# EAGLE design RMCB4 (EAGLE 9.5.2)
COMPANY: ADAFRUIT INDUSTRIES; DRAWN: KTOWN; REV: B
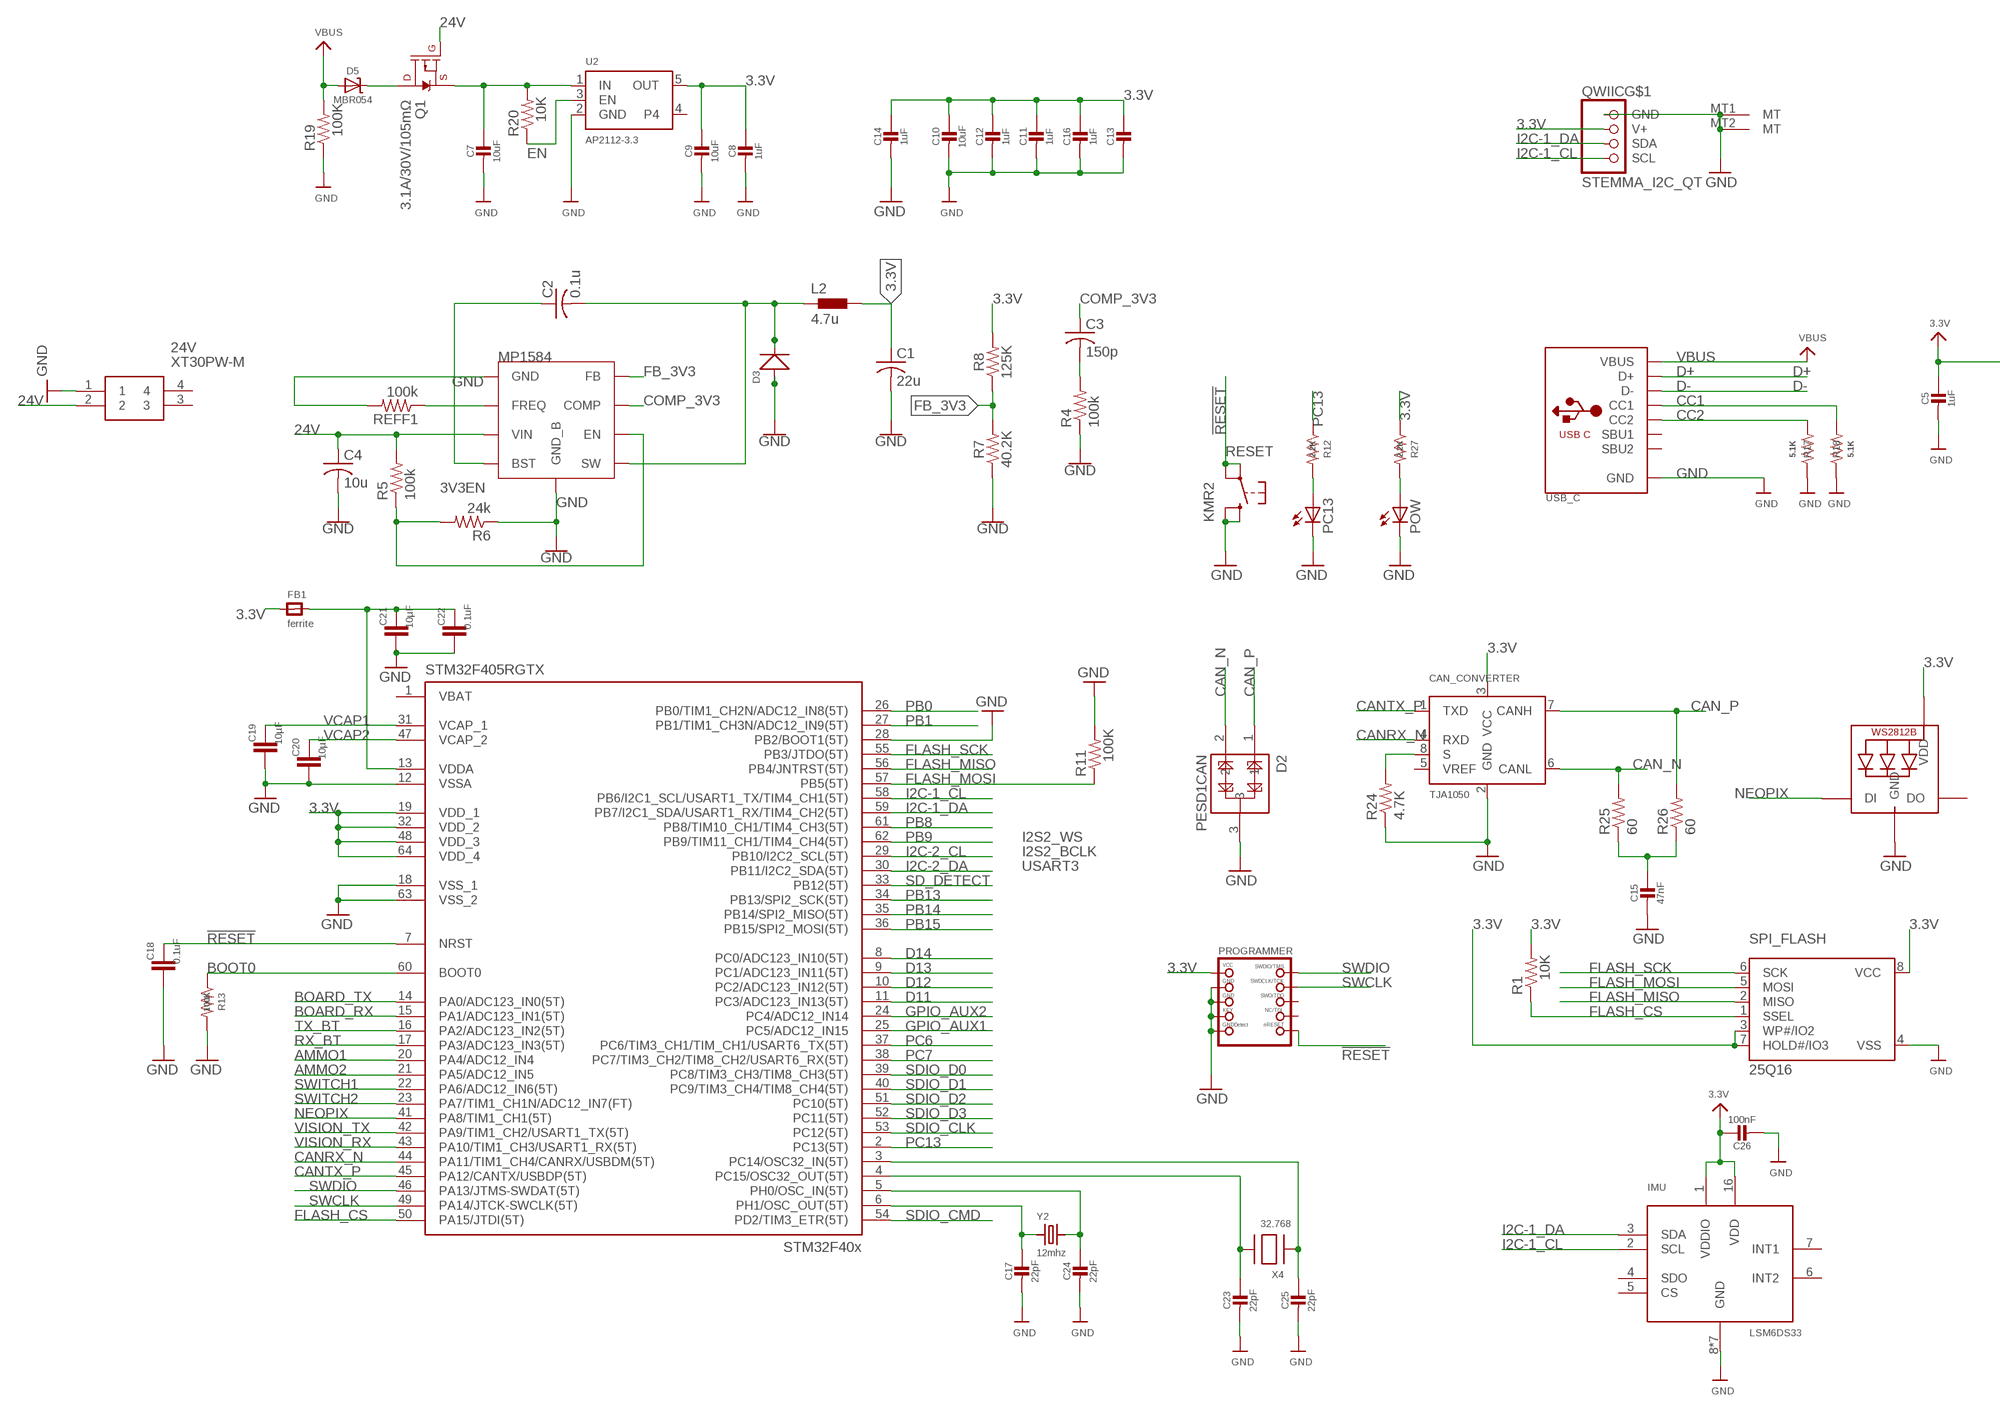
[diagram p0: schematic, sheet 1, part 1 of 2]
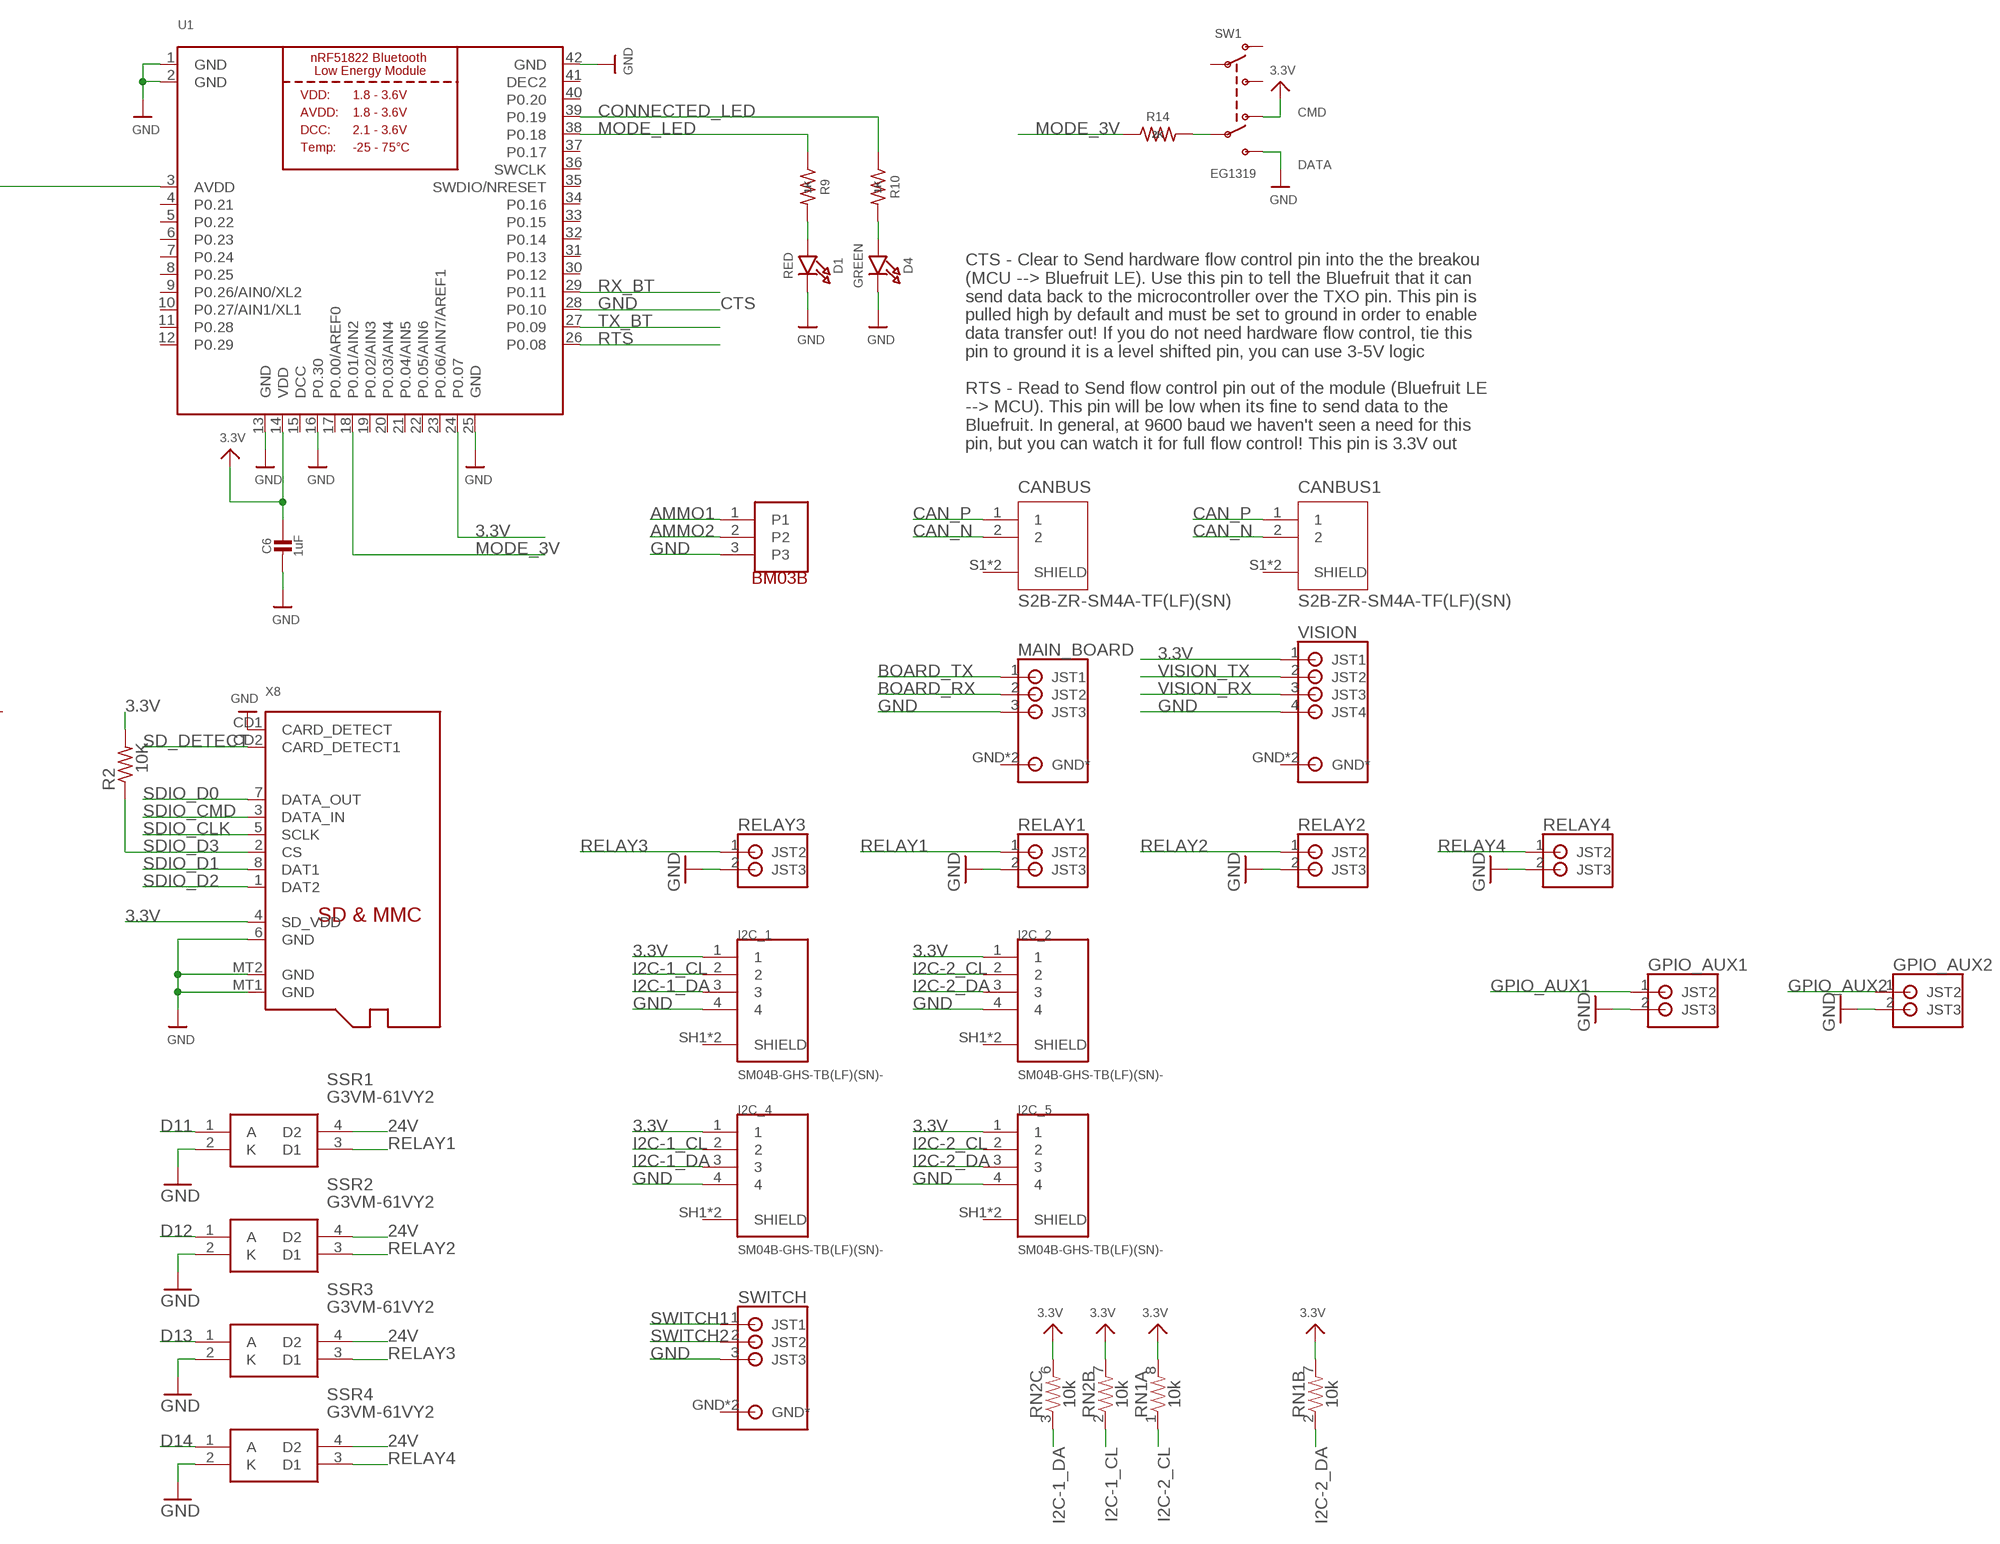
[diagram p1: schematic, sheet 1, part 2 of 2]

## Parts
24V  XT30PW-M  [XT30PWM]
AMMO_DETEC  BM03-GHS_TBT  [BM03-GHS-TBT]
C1  22u  C-USC1206  [C1206]
C2  0.1u  C-USC0603  [C0603]
C3  150p  C-USC0603  [C0603]
C4  10u  C-USC1206  [C1206]
C5  1uF  CAP_CERAMIC0805-NOOUTLINE  [0805-NO]
C6  1uF  CAP_CERAMIC0805-NOOUTLINE  [0805-NO]
C7  10uF  CAP_CERAMIC0603_NO  [0603-NO]
C8  1uF  CAP_CERAMIC0603_NO  [0603-NO]
C9  10uF  CAP_CERAMIC0603_NO  [0603-NO]
C10  10uF  CAP_CERAMIC0603_NO  [0603-NO]
C11  1uF  CAP_CERAMIC0603_NO  [0603-NO]
C12  1uF  CAP_CERAMIC0603_NO  [0603-NO]
C13  1uF  CAP_CERAMIC0603_NO  [0603-NO]
C14  1uF  CAP_CERAMIC0603_NO  [0603-NO]
C15  47nF  CAP_CERAMIC0603_NO  [0603-NO]
C16  1uF  CAP_CERAMIC0603_NO  [0603-NO]
C17  22pF  CAP_CERAMIC0603_NO  [0603-NO]
C18  0.1uF  C-EUC0603  [C0603]
C19  10µF  C-EUC0603  [C0603]
C20  10µF  C-EUC0603  [C0603]
C21  10µF  C-EUC0603  [C0603]
C22  0.1uF  C-EUC0603  [C0603]
C23  22pF  CAP_CERAMIC0603_NO  [0603-NO]
C24  22pF  CAP_CERAMIC0603_NO  [0603-NO]
C25  22pF  CAP_CERAMIC0603_NO  [0603-NO]
C26  100nF  CAP_CERAMIC0603_NO  [0603-NO]
CAN_CONVERTER  TJA1050  [SOT96-1]
CANBUS  S2B-ZR-SM4A-TF(LF)(SN)  [JST_S2B-ZR-SM4A-TF(LF)(SN)]
CANBUS1  S2B-ZR-SM4A-TF(LF)(SN)  [JST_S2B-ZR-SM4A-TF(LF)(SN)]
D1  RED  LED0805_NOOUTLINE  [CHIPLED_0805_NOOUTLINE]
D2  PESD1CAN  [SOT23-3]
D3  SMD-DIODE-SCHOTTKY-40V-3A(DO-214AB)  [DO-214AB]
D4  GREEN  LED0805_NOOUTLINE  [CHIPLED_0805_NOOUTLINE]
D5  MBR054  DIODE-SCHOTTKYSOD-123  [SOD-123]
FB1  ferrite  FERRITE-0805NO  [0805-NO@1]
GPIO_AUX1  S2B-PH-SM4_TB  [S2B-PH-SM4_TB]
GPIO_AUX2  S2B-PH-SM4_TB  [S2B-PH-SM4_TB]
I2C_1  SM04B-GHS-TB(LF)(SN)-  [JST_SM04B-GHS-TB(LF)(SN)-]
I2C_2  SM04B-GHS-TB(LF)(SN)-  [JST_SM04B-GHS-TB(LF)(SN)-]
I2C_4  SM04B-GHS-TB(LF)(SN)-  [JST_SM04B-GHS-TB(LF)(SN)-]
I2C_5  SM04B-GHS-TB(LF)(SN)-  [JST_SM04B-GHS-TB(LF)(SN)-]
IMU  LSM6DS33  [LGA16_3X3MM]
L2  4.7u  MHCI0603-4R7M-R8  [MHCI0603-4R7M-R8]
MAIN_BOARD  S3B-PH-SM4_TB  [S3B-PH-SM4_TB]
NEO  WS2812B3535  [LED3535]
PC13  LEDCHIPLED_0603  [CHIPLED_0603]
POW  LEDCHIPLED_0603  [CHIPLED_0603]
PROGRAMMER  JTAG-CORTEX  [2X05_1.27MM_SMT]
Q1  3.1A/30V/105mΩ  MOSFET_PCH-DMG2307L  [SOT23-3]
QWIIC  STEMMA_I2C_QT  [JST_SH4]
R1  10K  R-US_R0603  [R0603]
R2  10K  R-US_R0603  [R0603]
R4  100k  R-US_R0603  [R0603]
R5  100k  R-US_R0603  [R0603]
R6  24k  R-US_R0603  [R0603]
R7  40.2K  220KOHM-0603-1/10W-1%  [0603]
R8  125K  RESISTOR0603  [0603]
R9  1K  R-US_R0603  [R0603]
R10  1K  R-US_R0603  [R0603]
R11  100K  R-US_R0603  [R0603]
R12  2.2K  R-US_R0603  [R0603]
R13  100K  R-US_R0603  [R0603]
R14  2K  R-US_R0603  [R0603]
R17  5.1K  R-US_R0603  [R0603]
R18  5.1K  R-US_R0603  [R0603]
R19  100K  R-US_R0603  [R0603]
R20  10K  R-US_R0603  [R0603]
R24  4.7K  R-US_R0603  [R0603]
R25  60  R-US_R0603  [R0603]
R26  60  R-US_R0603  [R0603]
R27  2.2K  R-US_R0603  [R0603]
REFF1  100k  R-US_R0603  [R0603]
RELAY1  S2B-PH-SM4_TB  [S2B-PH-SM4_TB]
RELAY2  S2B-PH-SM4_TB  [S2B-PH-SM4_TB]
RELAY3  S2B-PH-SM4_TB  [S2B-PH-SM4_TB]
RELAY4  S2B-PH-SM4_TB  [S2B-PH-SM4_TB]
RESET  KMR2  SWITCH_TACT_SMT4.6X2.8  [BTN_KMR2_4.6X2.8]
RN1  10k  1KOHM-ARRAY(4)-0805_ARV-1/10W-5%  [0805-ARV]
RN2  10k  1KOHM-ARRAY(4)-0805_ARV-1/10W-5%  [0805-ARV]
SPI_FLASH  25Q16  SPIFLASH_8PIN  [SOIC8_150MIL]
SSR1  G3VM-61VY2  [SOP254P700X230-4N]
SSR2  G3VM-61VY2  [SOP254P700X230-4N]
SSR3  G3VM-61VY2  [SOP254P700X230-4N]
SSR4  G3VM-61VY2  [SOP254P700X230-4N]
STM32F405RGTX  STM32F405R  [TQFP64]
SW1  EG1319  SWITCH_DPDTEG1390  [EG1390]
SWITCH  S3B-PH-SM4_TB  [S3B-PH-SM4_TB]
U1  NRF51822_MODULE_MDBT40  [BLE_MODULE_RAYTAC_MDBT40]
U2  AP2112-3.3  VREG_SOT23-5  [SOT23-5]
U$10  MP1584_V2  [MP1584_V2]
USB_C  USB_C  [USB_C_CUSB31-CFM2AX-01-X]
VISION  S4B-PH-SM4_TB  [S4B-PH-SM4_TB]
X4  32.768  XTAL-3.2X1.5  [XTAL3215]
X8  MICROSD  [MICROSD]
Y2  12mhz  CRYSTAL2.5X2.0  [CRYSTAL_2.5X2]

## Nets
3.3V: C1.1 C5.1 C6.1 C8.1 C9.1 C10.1 C11.1 C12.1 C13.1 C14.1 C16.1 C26.1 CAN_CONVERTER.3(VCC) FB1.1 I2C_1.1 I2C_2.1 I2C_4.1 I2C_5.1 IMU.1(VDDIO) IMU.16(VDD) L2.P$2 NEO.2(VDD) PROGRAMMER.1(VCC) QWIIC.2(V+) R1.2 R2.2 R8.2 R27.1 RN1.7 RN1.8 RN2.6 RN2.7 SPI_FLASH.3(WP#/IO2) SPI_FLASH.7(HOLD#/IO3) SPI_FLASH.8(VCC) STM32F405RGTX.19(VDD_1) STM32F405RGTX.32(VDD_2) STM32F405RGTX.48(VDD_3) STM32F405RGTX.64(VDD_4) SW1.O2 U1.3(AVDD) U1.14(VDD) U1.24(P0.07) U2.5(OUT) VISION.1(JST1) X8.4(SD_VDD)
3V3EN: R5.1 R6.2 U$10.EN
24V [power]: 24V.2 C4.1 Q1.1(G) R5.2 SSR1.4(D2) SSR2.4(D2) SSR3.4(D2) SSR4.4(D2) U$10.VIN
!RESET: C18.1 PROGRAMMER.10(NRESET) RESET.A'(P1) RESET.A(P) STM32F405RGTX.7(NRST)
AMMO1: AMMO_DETEC.1 STM32F405RGTX.20(PA4/ADC12_IN4)
AMMO2: AMMO_DETEC.2 STM32F405RGTX.21(PA5/ADC12_IN5)
BOARD_RX: MAIN_BOARD.2(JST2) STM32F405RGTX.15(PA1/ADC123_IN1(5T))
BOARD_TX: MAIN_BOARD.1(JST1) STM32F405RGTX.14(PA0/ADC123_IN0(5T))
BOOT0: R13.1 STM32F405RGTX.60(BOOT0)
BST1: C2.1 U$10.BST
CAN_N: CAN_CONVERTER.6(CANL) CANBUS1.2 CANBUS.2 D2.2 R25.2
CAN_P: CAN_CONVERTER.7(CANH) CANBUS1.1 CANBUS.1 D2.1 R26.2
CANRX_N: CAN_CONVERTER.4(RXD) STM32F405RGTX.44(PA11/TIM1_CH4/CANRX/USBDM(5T))
CANTX_P: CAN_CONVERTER.1(TXD) STM32F405RGTX.45(PA12/CANTX/USBDP(5T))
CC1: R18.2 USB_C.A5(CC1)
CC2: R17.2 USB_C.B5(CC2)
COMP_3V3: C3.1 U$10.COMP
CONNECTED_LED: R10.1 U1.39(P0.19)
D11: SSR1.1(A) STM32F405RGTX.11(PC3/ADC123_IN13(5T))
D12: SSR2.1(A) STM32F405RGTX.10(PC2/ADC123_IN12(5T))
D13: SSR3.1(A) STM32F405RGTX.9(PC1/ADC123_IN11(5T))
D14: SSR4.1(A) STM32F405RGTX.8(PC0/ADC123_IN10(5T))
D+: USB_C.A6(D+) USB_C.B6(D+)
D-: USB_C.A7(D-) USB_C.B7(D-)
EN: R20.1 U2.3(EN)
FB_3V3: R7.2 R8.1 U$10.FB
FLASH_CS: R1.1 SPI_FLASH.1(SSEL) STM32F405RGTX.50(PA15/JTDI(5T))
FLASH_MISO: SPI_FLASH.2(MISO) STM32F405RGTX.56(PB4/JNTRST(5T))
FLASH_MOSI: R11.1 SPI_FLASH.5(MOSI) STM32F405RGTX.57(PB5(5T))
FLASH_SCK: SPI_FLASH.6(SCK) STM32F405RGTX.55(PB3/JTDO(5T))
FREQ1: REFF1.1 U$10.FREQ
GND [gnd]: 24V.1 AMMO_DETEC.3 C1.2 C4.2 C5.2 C6.2 C7.2 C8.2 C9.2 C10.2 C11.2 C12.2 C13.2 C14.2 C15.2 C16.2 C17.2 C18.2 C19.2 C20.2 C21.2 C22.2 C23.2 C24.2 C25.2 C26.2 CAN_CONVERTER.2(GND) D1.C D2.3 D3.1(+) D4.C GPIO_AUX1.2(JST3) GPIO_AUX2.2(JST3) I2C_1.4 I2C_2.4 I2C_4.4 I2C_5.4 IMU.8(GND) IMU.9(GND) IMU.10(GND) IMU.11(GND) IMU.12(GND) IMU.13(GND) IMU.15(GND) MAIN_BOARD.3(JST3) NEO.4(GND) PC13.C POW.C PROGRAMMER.3(GND) PROGRAMMER.5(GND) PROGRAMMER.7(KEY) PROGRAMMER.9(GNDDETECT) QWIIC.1(GND) QWIIC.MT1(MT) QWIIC.MT2(MT) R4.1 R6.1 R7.1 R11.2 R13.2 R17.1 R18.1 R19.1 R24.1 REFF1.2 RELAY1.2(JST3) RELAY2.2(JST3) RELAY3.2(JST3) RELAY4.2(JST3) RESET.B'(S1) RESET.B(S) SPI_FLASH.4(VSS) SSR1.2(K) SSR2.2(K) SSR3.2(K) SSR4.2(K) STM32F405RGTX.12(VSSA) STM32F405RGTX.18(VSS_1) STM32F405RGTX.28(PB2/BOOT1(5T)) STM32F405RGTX.63(VSS_2) SW1.S2 SWITCH.3(JST3) U1.1(GND) U1.2(GND) U1.13(GND) U1.16(P0.30) U1.25(GND) U1.28(P0.10) U1.42(GND) U2.2(GND) U$10.GND U$10.GND_B USB_C.A1B12(GND) USB_C.B1A12(GND) VISION.4(JST4) X8.6(GND) X8.CD1(CARD_DETECT) X8.MT1(GND) X8.MT2(GND)
GPIO_AUX1: GPIO_AUX1.1(JST2) STM32F405RGTX.25(PC5/ADC12_IN15)
GPIO_AUX2: GPIO_AUX2.1(JST2) STM32F405RGTX.24(PC4/ADC12_IN14)
I2C-1_CL: I2C_1.2 I2C_4.2 IMU.2(SCL) QWIIC.4(SCL) RN2.2 STM32F405RGTX.58(PB6/I2C1_SCL/USART1_TX/TIM4_CH1(5T))
I2C-1_DA: I2C_1.3 I2C_4.3 IMU.3(SDA) QWIIC.3(SDA) RN2.3 STM32F405RGTX.59(PB7/I2C1_SDA/USART1_RX/TIM4_CH2(5T))
I2C-2_CL: I2C_2.2 I2C_5.2 RN1.1 STM32F405RGTX.29(PB10/I2C2_SCL(5T))
I2C-2_DA: I2C_2.3 I2C_5.3 RN1.2 STM32F405RGTX.30(PB11/I2C2_SDA(5T))
MODE_3V: R14.1 U1.18(P0.01/AIN2)
MODE_LED: R9.1 U1.38(P0.18)
N$3: C3.2 R4.2
N$4: R14.2 SW1.P2
N$5: D1.A R9.2
N$6: D4.A R10.2
N$9: C25.1 STM32F405RGTX.3(PC14/OSC32_IN(5T)) X4.P$1
N$10: C23.1 STM32F405RGTX.4(PC15/OSC32_OUT(5T)) X4.P$2
N$11: C24.1 STM32F405RGTX.5(PH0/OSC_IN(5T)) Y2.3
N$12: C17.1 STM32F405RGTX.6(PH1/OSC_OUT(5T)) Y2.1
N$13: PC13.A R12.2
N$20: C21.1 C22.1 FB1.2 STM32F405RGTX.13(VDDA)
N$21: CAN_CONVERTER.8(S) R24.2
N$22: C15.1 R25.1 R26.1
N$23: POW.A R27.2
N$32: D5.C Q1.3(D)
NEOPIX: NEO.1(DI) STM32F405RGTX.41(PA8/TIM1_CH1(5T))
PB0: STM32F405RGTX.26(PB0/TIM1_CH2N/ADC12_IN8(5T))
PB1: STM32F405RGTX.27(PB1/TIM1_CH3N/ADC12_IN9(5T))
PB8: STM32F405RGTX.61(PB8/TIM10_CH1/TIM4_CH3(5T))
PB9: STM32F405RGTX.62(PB9/TIM11_CH1/TIM4_CH4(5T))
PB13: STM32F405RGTX.34(PB13/SPI2_SCK(5T))
PB14: STM32F405RGTX.35(PB14/SPI2_MISO(5T))
PB15: STM32F405RGTX.36(PB15/SPI2_MOSI(5T))
PC6: STM32F405RGTX.37(PC6/TIM3_CH1/TIM_CH1/USART6_TX(5T))
PC7: STM32F405RGTX.38(PC7/TIM3_CH2/TIM8_CH2/USART6_RX(5T))
PC13: R12.1 STM32F405RGTX.2(PC13(5T))
RELAY1: RELAY1.1(JST2) SSR1.3(D1)
RELAY2: RELAY2.1(JST2) SSR2.3(D1)
RELAY3: RELAY3.1(JST2) SSR3.3(D1)
RELAY4: RELAY4.1(JST2) SSR4.3(D1)
RTS: U1.26(P0.08)
RX_BT: STM32F405RGTX.17(PA3/ADC123_IN3(5T)) U1.29(P0.11)
SD_DETECT: STM32F405RGTX.33(PB12(5T)) X8.CD2(CARD_DETECT1)
SDIO_CLK: STM32F405RGTX.53(PC12(5T)) X8.5(SCLK)
SDIO_CMD: STM32F405RGTX.54(PD2/TIM3_ETR(5T)) X8.3(DATA_IN)
SDIO_D0: STM32F405RGTX.39(PC8/TIM3_CH3/TIM8_CH3(5T)) X8.7(DATA_OUT)
SDIO_D1: STM32F405RGTX.40(PC9/TIM3_CH4/TIM8_CH4(5T)) X8.8(DAT1)
SDIO_D2: STM32F405RGTX.51(PC10(5T)) X8.1(DAT2)
SDIO_D3: R2.1 STM32F405RGTX.52(PC11(5T)) X8.2(CS)
SW1: C2.2 D3.2(-) L2.P$1 U$10.SW
SWCLK: PROGRAMMER.4(SWDCLK) STM32F405RGTX.49(PA14/JTCK-SWCLK(5T))
SWDIO: PROGRAMMER.2(SWDIO) STM32F405RGTX.46(PA13/JTMS-SWDAT(5T))
SWITCH1: STM32F405RGTX.22(PA6/ADC12_IN6(5T)) SWITCH.1(JST1)
SWITCH2: STM32F405RGTX.23(PA7/TIM1_CH1N/ADC12_IN7(FT)) SWITCH.2(JST2)
TX_BT: STM32F405RGTX.16(PA2/ADC123_IN2(5T)) U1.27(P0.09)
VBUS [power]: D5.A R19.2 USB_C.A4B9(VBUS) USB_C.B4A9(VBUS)
VCAP1: C19.1 STM32F405RGTX.31(VCAP_1)
VCAP2: C20.1 STM32F405RGTX.47(VCAP_2)
VHI: C7.1 Q1.2(S) R20.2 U2.1(IN)
VISION_RX: STM32F405RGTX.43(PA10/TIM1_CH3/USART1_RX(5T)) VISION.3(JST3)
VISION_TX: STM32F405RGTX.42(PA9/TIM1_CH2/USART1_TX(5T)) VISION.2(JST2)
Unconnected: 24V.3 24V.4 CAN_CONVERTER.5(VREF) CANBUS1.S1(SHIELD) CANBUS1.S2(SHIELD) CANBUS.S1(SHIELD) CANBUS.S2(SHIELD) IMU.4(SDO) IMU.5(CS) IMU.6(INT2) IMU.7(INT1) MAIN_BOARD.GND2(GND*) MAIN_BOARD.GND(GND*) NEO.3(DO) PROGRAMMER.6(SWO) PROGRAMMER.8(TDI) RN1.3 RN1.4 RN1.5 RN1.6 RN2.1 RN2.4 RN2.5 RN2.8 STM32F405RGTX.1(VBAT) SW1.O1 SW1.P1 SW1.S1 SWITCH.GND2(GND*) SWITCH.GND(GND*) U1.4(P0.21) U1.5(P0.22) U1.6(P0.23) U1.7(P0.24) U1.8(P0.25) U1.9(P0.26/AIN0/XL2) U1.10(P0.27/AIN1/XL1) U1.11(P0.28) U1.12(P0.29) U1.17(P0.00/AREF0) U1.19(P0.02/AIN3) U1.20(P0.03/AIN4) U1.21(P0.04/AIN5) U1.22(P0.05/AIN6) U1.23(P0.06/AIN7/AREF1) U1.30(P0.12) U1.31(P0.13) U1.32(P0.14) U1.33(P0.15) U1.34(P0.16) U1.35(SWDIO/NRESET) U1.36(SWCLK) U1.37(P0.17) U1.40(P0.20) U2.4 USB_C.A8(SBU1) USB_C.B8(SBU2) VISION.GND2(GND*) VISION.GND(GND*)

## Notes on the sheet
- CMD
- DATA
- CTS
- CTS - Clear to Send hardware flow control pin into the the breakou 
  (MCU --> Bluefruit LE). Use this pin to tell the Bluefruit that it can 
  send data back to the microcontroller over the TXO pin. This pin is 
  pulled high by default and must be set to ground in order to enable 
  data transfer out! If you do not need hardware flow control, tie this 
  pin to ground it is a level shifted pin, you can use 3-5V logic
  
  RTS - Read to Send flow control pin out of the module (Bluefruit LE 
  --> MCU). This pin will be low when its fine to send data to the 
  Bluefruit. In general, at 9600 baud we haven't seen a need for this 
  pin, but you can watch it for full flow control! This pin is 3.3V out
- I2S2_WS
- I2S2_BCLK
- USART3

## Power pins joined to a net without a drawn wire
DCC: U1.15(DCC)
DEC2: U1.41(DEC2)
SHIELD: I2C_1.SH1(SHIELD) I2C_1.SH2(SHIELD) I2C_2.SH1(SHIELD) I2C_2.SH2(SHIELD) I2C_4.SH1(SHIELD) I2C_4.SH2(SHIELD) I2C_5.SH1(SHIELD) I2C_5.SH2(SHIELD)

## Library data of the parts
24V = SamacSys_Parts:XT30PW-M: 30A Low Temperature Rise Fire Retardant Plug Source: Datasheet <https://www.tme.eu/sl/Document/ce4077e36b79046da520ca73227e15de/XT30PW SPEC.pdf>; DESCRIPTION: 30A Low Temperature Rise Fire Retardant Plug; HEIGHT: 5mm; MANUFACTURER_NAME: Amass; MANUFACTURER_PART_NUMBER: XT30PW-M
AMMO_DETEC = SamacSys_Parts:BM03-GHS_TBT
C1-C4 = adafruit:C-US: CAPACITOR, American symbol
C5-C17 C23-C26 = microbuilder:CAP_CERAMIC: Ceramic Capacitors For new designs, use the packages preceded by an '_' character since they are more reliable: The following footprints should be used on most boards: _0402 - Standard footprint for regular board layouts _0603 - Standard footprint for regular board layouts _0805 - Standard footprint for regular board layouts _1206 - Standard footprint for regular board layouts For extremely tight-pitch boards where space is at a premium, the following 'micro-pitch' footprints can be used (smaller pads, no silkscreen outline, etc.): _0402MP - Micro-pitch footprint for very dense/compact boards _0603MP - Micro-pitch footprint for very dense/compact boards _0805MP - Micro-pitch footprint for very dense/compact boards _1206MP - Micro-pitch footprint for very dense/compact boards
C18-C22 = rcl:C-EU: CAPACITOR, European symbol; SPICEPREFIX: C
CAN_CONVERTER = TJA1050:TJA1050: High speed CAN transceiver The TJA1050 is the interface between the Controller Area Network (CAN) protocol controller and the physical bus. The device provides differential transmit capability to the bus and differential receive capability to the CAN controller. The TJA1050 is the third Philips high-speed CAN transceiver after the PCA82C250 and the PCA82C251. The most important differences are: Much lower electromagnetic emission due to optimal matching of the output signals CANH and CANL Improved behaviour in case of an unpowered node No standby mode. This makes the TJA1050 eminently suitable for use in nodes that are in a power-down situation in partially powered networks. AAL Eindhoven MK; AVAILABILITY: Unavailable; DESCRIPTION: 1/1 Transceiver Half CANbus 8-SO; MF: NXP USA; MP: TJA1050; PACKAGE: SOIC-8 NXP USA; PRICE: None
CANBUS CANBUS1 = S2B-ZR-SM4A-TF_LF__SN_:S2B-ZR-SM4A-TF(LF)(SN): ZH Series 2 Position 1.5 mm Pitch Surface Mount Side Entry Shrouded Header; AVAILABILITY: Unavailable; DESCRIPTION: Connector Header Surface Mount, Right Angle 2 position 0.059 _1.50mm_; MF: JST Sales; MP: S2B-ZR-SM4A-TF_LF__SN_; PACKAGE: None; PRICE: None
D1 D4 = microbuilder:LED: LED
D2 = PESD1CAN:PESD1CAN: PESD1CAN is used to protect two automotive CAN bus lines from ESD.; AVAILABILITY: Unavailable; DESCRIPTION: 50V Clamp 3A _8/20µs_ Ipp Tvs Diode Surface Mount SC-70; MF: NXP Semiconductors; MP: PESD1CAN; PACKAGE: SC-70 NXP Semiconductors; PRICE: None
D3 = SMD-DIODE-SCHOTTKY-40V-3A_DO-214AB_:SMD-DIODE-SCHOTTKY-40V-3A(DO-214AB): 304020018; AVAILABILITY: Unavailable; DESCRIPTION: Rectifier, Schottky; DO-214AB; 3.0A IF; 0.75V; 40V; 100A IFRM; 10000V/us; 1000pF; MF: Vishay; MP: SS34-E3/57T; PACKAGE: DO-214 Vishay; PRICE: None
D5 = microbuilder:DIODE-SCHOTTKY
FB1 = microbuilder:FERRITE: Ferrite Bead 0603 MMZ1608B121C - 120 Ohm @ 100MHz, 600mA, 0.15 Ohm DC Resistance - Digikey: 445-2164-1-ND BK1608HW121-T - 120 Ohm, 600mA Ferrite Chip - Digikey: 587-1876-2-ND 0805 HZ0805B272R-10 - 2.7K Ohm @ 100MHz, 200mA, 0.8 Ohm DC Resistance - Digikey: 240-2504-1-ND (see also Murata BLM21BD272SN1L) MMZ2012Y152B - 1.5K Ohm @ 100MHz, 500mA, 0.4 Ohm DC Resistance - Digikey: 445-1560-1-ND - Mainly for high frequency (80-400MHz) MMZ2012R102A - 1K Ohm @ 100MHz, 500mA, 0.3 Ohm DC Resistance - Digikey: 445-1555-2-ND - More general purpose (10-200MHz)
GPIO_AUX1 GPIO_AUX2 RELAY1-RELAY4 = KevinMade:S2B-PH-SM4_TB
I2C_1 I2C_2 I2C_4 I2C_5 = SM04B-GHS-TB_LF__SN_-:SM04B-GHS-TB(LF)(SN)-: Conn Header Gh Side 4pos 1.25mm; AVAILABILITY: Unavailable; DESCRIPTION: Connector Header Surface Mount, Right Angle 4 position 0.049 _1.25mm_; MF: JST Sales; MP: SM04B-GHS-TB_LF__SN_-; PACKAGE: None; PRICE: None
IMU = adafruit_sensor:LSM6DS33
L2 = NewKevinMade:MHCI0603-4R7M-R8
MAIN_BOARD SWITCH = KevinMade:S3B-PH-SM4_TB
NEO = microbuilder:WS2812B
PC13 POW = adafruit:LED: LED
PROGRAMMER = microbuilder:JTAG-CORTEX: Serial Wire (SW-DP) Connector Standard 0.05" 10-pin connector is for use with the Cortex M and Cortex A SWD (serial wire debugger) interface (SW-DP) Connectors 2x05_1.27MM_SMT - Inexpensive surface-mount header with bare pins, compatible with standard 10-pin SWD cables (4UCON: 16846) 2x05_1.27MM_BOX_NOPOSTS - Polarised surface-mount box (4UCON with caps: 19735, without caps: 15117 2x05_1.27MM_BOX_POSTS - Polarised surface-mount box with mounting holes (4UCON: 20317) Pinout: http://infocenter.arm.com/help/topic/com.arm.doc.faqs/attached/13634/cortex_debug_connectors.pdf http://www.keil.com/peripherals/coresight/connectors.asp
Q1 = SparkFun-DiscreteSemi:MOSFET_PCH: P-channel MOSFETs Voltage controlled devices that allow control of high current outputs. SparkFun Products: SparkFun ESP32 Thing <https://www.sparkfun.com/products/13907> SparkFun ESP8266 Thing <https://www.sparkfun.com/products/13231> SparkFun Pi Servo HAT V2 <https://www.sparkfun.com/products/15316> DMG2305UX-7 (20V/4.2A/SOT23-3); PROD_ID: TRANS-11308
QWIIC = microbuilder:STEMMA_I2C
R1 R2 R9-R14 R17-R20 R27 = rcl:R-US_: RESISTOR, American symbol; SPICEPREFIX: R
R4-R6 R24-R26 REFF1 = adafruit:R-US_: RESISTOR, American symbol
R7 = SparkFun-Resistors:220KOHM: 220kΩ resistor A resistor is a passive two-terminal electrical component that implements electrical resistance as a circuit element. Resistors act to reduce current flow, and, at the same time, act to lower voltage levels within circuits. - Wikipedia; PROD_ID: RES-08969; VALUE: 220k
R8 = SparkFun-Resistors:RESISTOR: Generic Resistor Package
RESET = microbuilder:SWITCH_TACT_SMT: SMT Tact Switches 6x6mm - Digikey: P12940SCT-ND KMR2 (4.6x2.8mm) - Digikey: 401-1426-1-ND EVQ-PQHB55 - Light Touch, 160GF (4.5x4.5mm) - Digikey: P8090SCT-ND KMT0 - KMT021 NGJ LHS (etc.) IP68/Waterproof - Digikey: CKN10289CT-ND
RN1 RN2 = SparkFun-Resistors:1KOHM-ARRAY(4): 4 x 1kΩ resistor array A resistor is a passive two-terminal electrical component that implements electrical resistance as a circuit element. Resistors act to reduce current flow, and, at the same time, act to lower voltage levels within circuits. - Wikipedia An array is a collection of discrete resistors in a single package.; PROD_ID: RES-13020; VALUE: 1k
SPI_FLASH = microbuilder:SPIFLASH_8PIN: SOIC8 SPI Flash Be careful with the size since SOIC8 flash comes in several 'widths' SOIC8 150 mil M25P16 - 16Mbit (2Mbit x 8) Serial Flash (75MHz SPI Bus), Supply: 2.7-3.6V Digikey: SOIC8 - M25P16-VMN6P-ND SOIC8 208 mil W25Q16BVSSIG - 16Mbit (2Mbit x 8) Serial Flash (104MHz SPI Bus), Supply: 2.7-3.6V Digikey: SOIC8 - W25Q16BVSSIG-ND
SSR1-SSR4 = SamacSys_Parts:G3VM-61VY2: Solid State Relays - PCB Mount Mos Fet Relay, SMT 60V, 1 form A,SOP4 Source: Datasheet <https://componentsearchengine.com/Datasheets/1/G3VM-61VY2.pdf>; DESCRIPTION: Solid State Relays - PCB Mount Mos Fet Relay, SMT 60V, 1 form A,SOP4; HEIGHT: 2.3mm; MANUFACTURER_NAME: Omron Electronics; MANUFACTURER_PART_NUMBER: G3VM-61VY2; MOUSER_PART_NUMBER: 653-G3VM61VY2; MOUSER_PRICE-STOCK: https://www.mouser.com/Search/Refine.aspx?Keyword=653-G3VM61VY2
STM32F405RGTX = adafruit_micro:STM32F405R: STM32F405 64 pin LQFP reviewed: YES tested: YES
SW1 = microbuilder:SWITCH_DPDT: Switch - DPDT A DPDT Switch acts like an SPDT switch, but has a pair of switches instead of just one. Vertical - 0.3A @ 6V SMT - Digikey: JS202011SCQN
U1 = microbuilder:NRF51822_MODULE_MDBT40: nRF51822 Bluetooth Low Energy Module
U2 = microbuilder:VREG_SOT23-5: SOT23-5 Fixed Voltage Regulators Part Current Out V Out V In V Dropout θJA (°C/W) TJ (°C) Digikey Part No. ADP121 150mA 3.3V 3.4-5.5V 0.09V @ 150mA -- -- ADP121-AUJZ33R7CT-ND ADP121 150mA 3.0V 3.1-5.5V 0.09V @ 150mA -- -- ADP121-AUJZ30R7CT-ND ADP122 300mA 3.3V 3.4-5.5V 0.085V @ 300mA -- -- ADP122AUJZ-3.3-R7CT-ND ADP1712 300mA 3.3V 3.5-5.5V 0.17V @ 300mA -- -- ADP1712AUJZ-3.3-R7TR-ND AP7311 (Low Cost) 150mA 3.3V 3.5-6V 0.15V @ 150mA -- -- AP7311-33WG-7DICT-ND LD39015M18R 150mA 1.8V 1.9V-5.5V 0.08V @ 100mA -- -- 497-6977-1-ND LP2985A-33DBVR 150mA 3.3V 3.3-16V 0.28V @ 150mA 206 150 296-18479-1-ND MCP1824T-3302E/OT 300mA 3.3V 3.5V-6V 0.2V @ 300mA -- -- MCP1824T-3302E/OTCT-ND MIC5205-2.5YM5 TR 150mA 2.5V 2.7-16V 0.165V @ 150mA -- -- 576-1257-2-ND MIC5205-3.0YM5 TR 150mA 3.0V 3.2V-16V 0.165V @ 150mA -- -- 576-1258-2-ND MIC5205-3.3YM5 TR 150mA 3.3V 3.5V-16V 0.165V @ 150mA -- -- 576-1259-2-ND TPS780330220 150mA 3.3V+2.2V 3.6-5.5V 250mV Max -- -- 296-23332-1-ND TDA3663/N1,135 100mA 3.3V 3.5-45V 0.18V @ 50mA -- -- 568-5343-1-ND Max operating temp can be calculated using θJA, TJ (max junction temperature), and power in watts. Set the "Maximum Ambient Temperature" until it reaches TJ ("Max Junction Temperature"), which is the absolute limit for safe use of the regulator: Heat Sink Temperature Calculator <http://www.daycounter.com/Calculators/Heat-Sink-Temperature-Calculator.phtml> For example, With 12V source into a 3.3V LP2985 and a 30mA load, we are dissipating (12V-3.3V) * 0.03A = 0.261W. With a θJA of 206 °C/W, a TJ of 150°C, and 261mW we can safely use the chip without a heat sink up to 75°C (=147.1°C Junction Temperature).
U$10 = mp1584S:MP1584_V2
USB_C = microbuilder:USB_C: USB Type-C USB 2.0 Connector
VISION = KevinMade:S4B-PH-SM4_TB
X4 = adafruit2:XTAL: Low cost SMT crystals, no capacitors included http://www.ladyada.net/library/eagle
X8 = microbuilder:MICROSD: MicroSD/Transflash Card Holder with SPI pinout 3M: 2908-05WB-MG 4UConnector: 19656 Footprint courtesy: Adafruit Industries
Y2 = microbuilder:CRYSTAL: Crystals HC49UP - Surface Mount Crystal 4.0MHz 18pF +/-30ppm Surface Mount Crystal [Digikey: 535-9857-1-ND] 12.0 MHz Surface Mount Crystal [Digikey: 535-9869-6-ND] 25.0 MHz Surface Mount Crystal [Digikey: 535-9078-1-ND] 2.5 x 2.0mm - MEMs SMT Crystal 16.0 MHz 10pF 20ppm 2.5 x 2.0mm Crystal [Digikey -40-85°C: 535-10923-1-ND] 3.2 x 2.5mm - MEMs SMT Crystal 12.0 MHz 8pF 15ppm 3.2 x 2.5mm Crystal [Digikey: -10-70°C: 644-1047-1-ND -40-125°C: 644-1128-1-ND] 40~85°C cheaper: 644-1173-6-ND 16.0 MHz 8pF 15ppm 3.2 x 2.5mm Crystal [Digikey: -10-70°C: 644-1049-1-ND -40-125°C: 644-1129-2-ND]-40~85°C cheaper: 644-1175-6-ND 16.0 MHz 10pF 10ppm 3.2 x 2.5mm Crystal [Digikey: 644-1100-1-ND] 27.12 MHz 18pF 30ppm 3.2 x 2.5mm Crystal [Digikey: 887-1424-1-ND] 27.12MHz 10pF 10ppm 3.2 x 2.5mm Crystal [Digikey: 887-1329-1-ND] 4.9 x 1.8mm - MEMs SMT Crystal 32.768 KHz 12.5pF 20ppm 4.9 x 1.8mm Crystal [Digikey: SE2415CT-ND] 8.0 x 3.8mm - Surface Mount Crystal 32.768kHz 12.5pF 20ppm -40°C-85°C [Digikey: 535-9166-2-ND] Cylinder 32.768KHz Cylinder Crystal (2x6mm body) [Ex. Digikey: 300-8341-2-ND]

## Net classes
1 power: width 0.305 mm
2 gnd: width 0.254 mm
3 can: width 0.203 mm
4 canx: width 0.203 mm

## Board
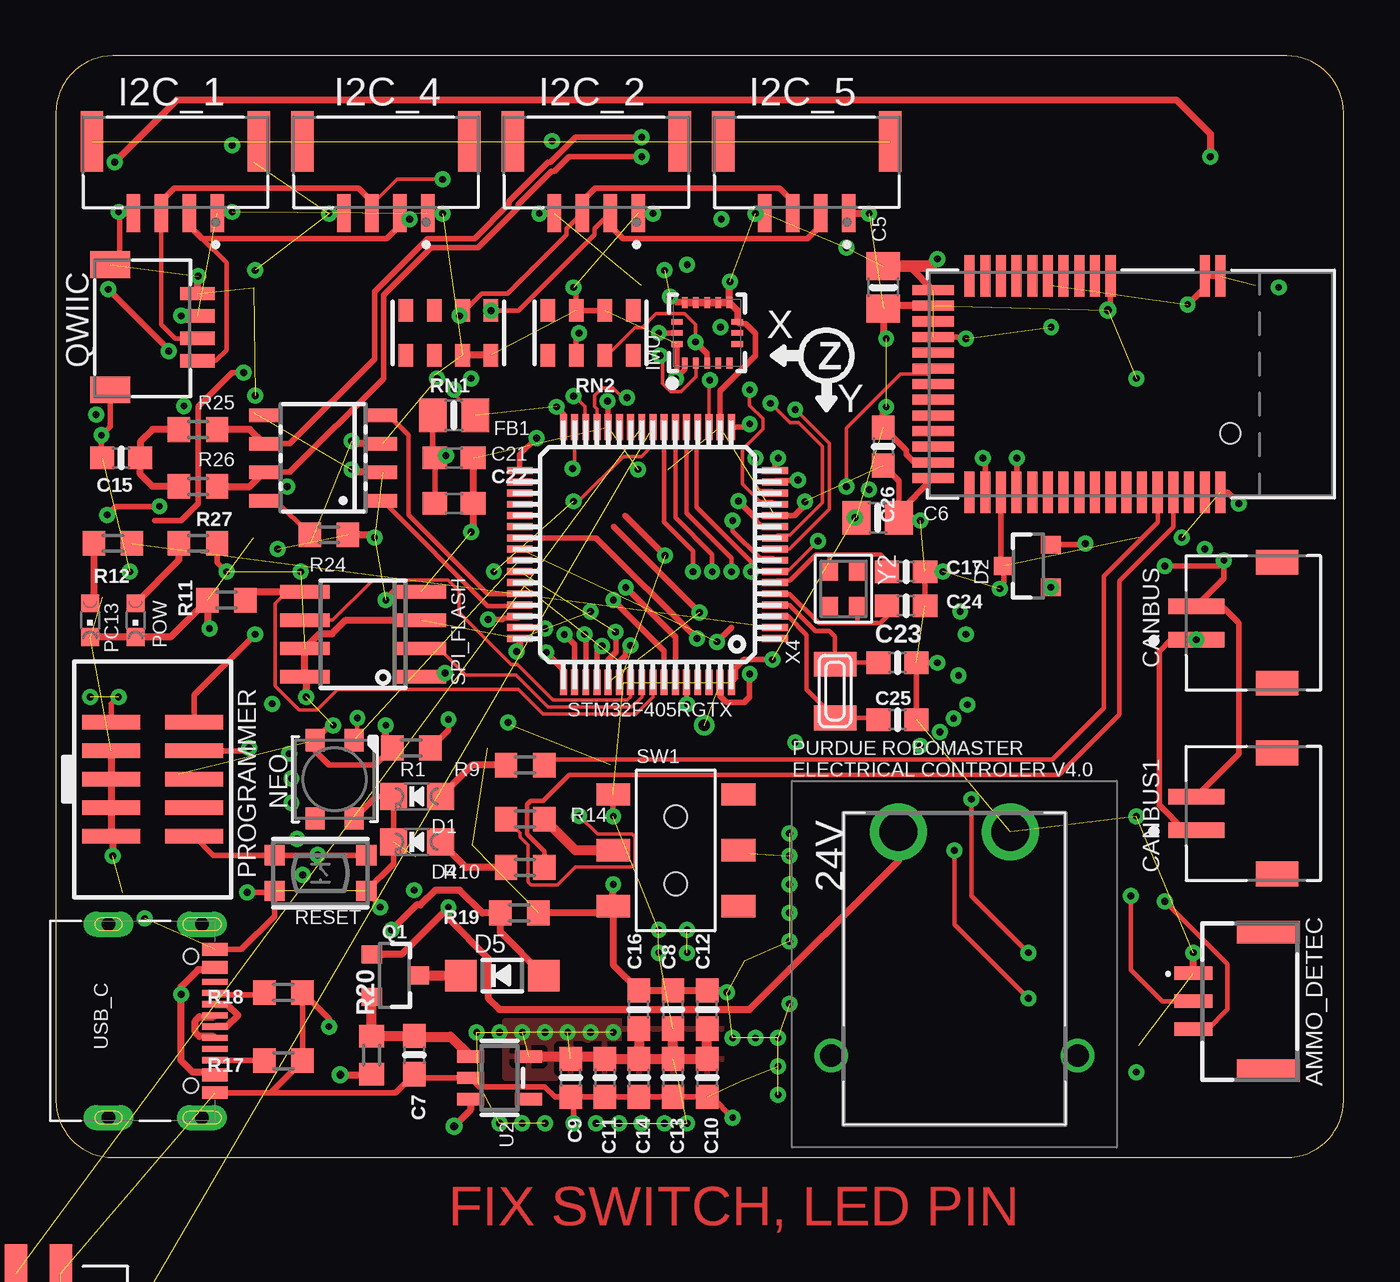
[diagram p2: board, top side]
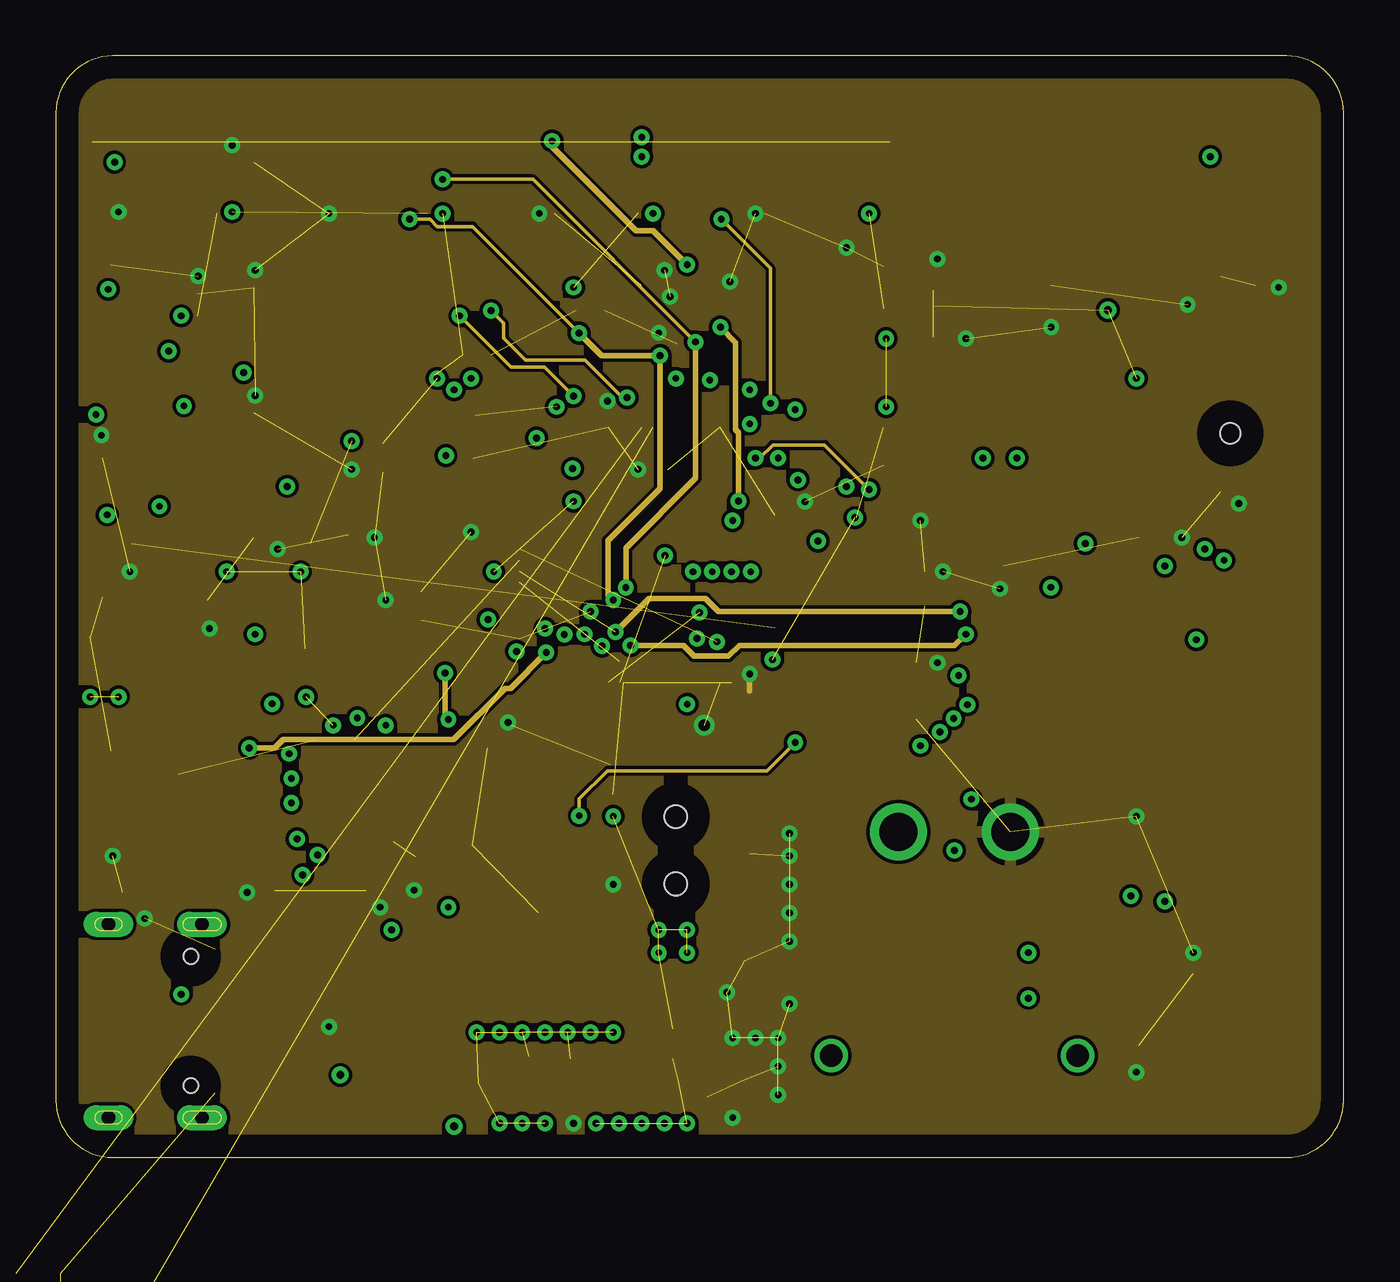
[diagram p3: board, inner layer GND]
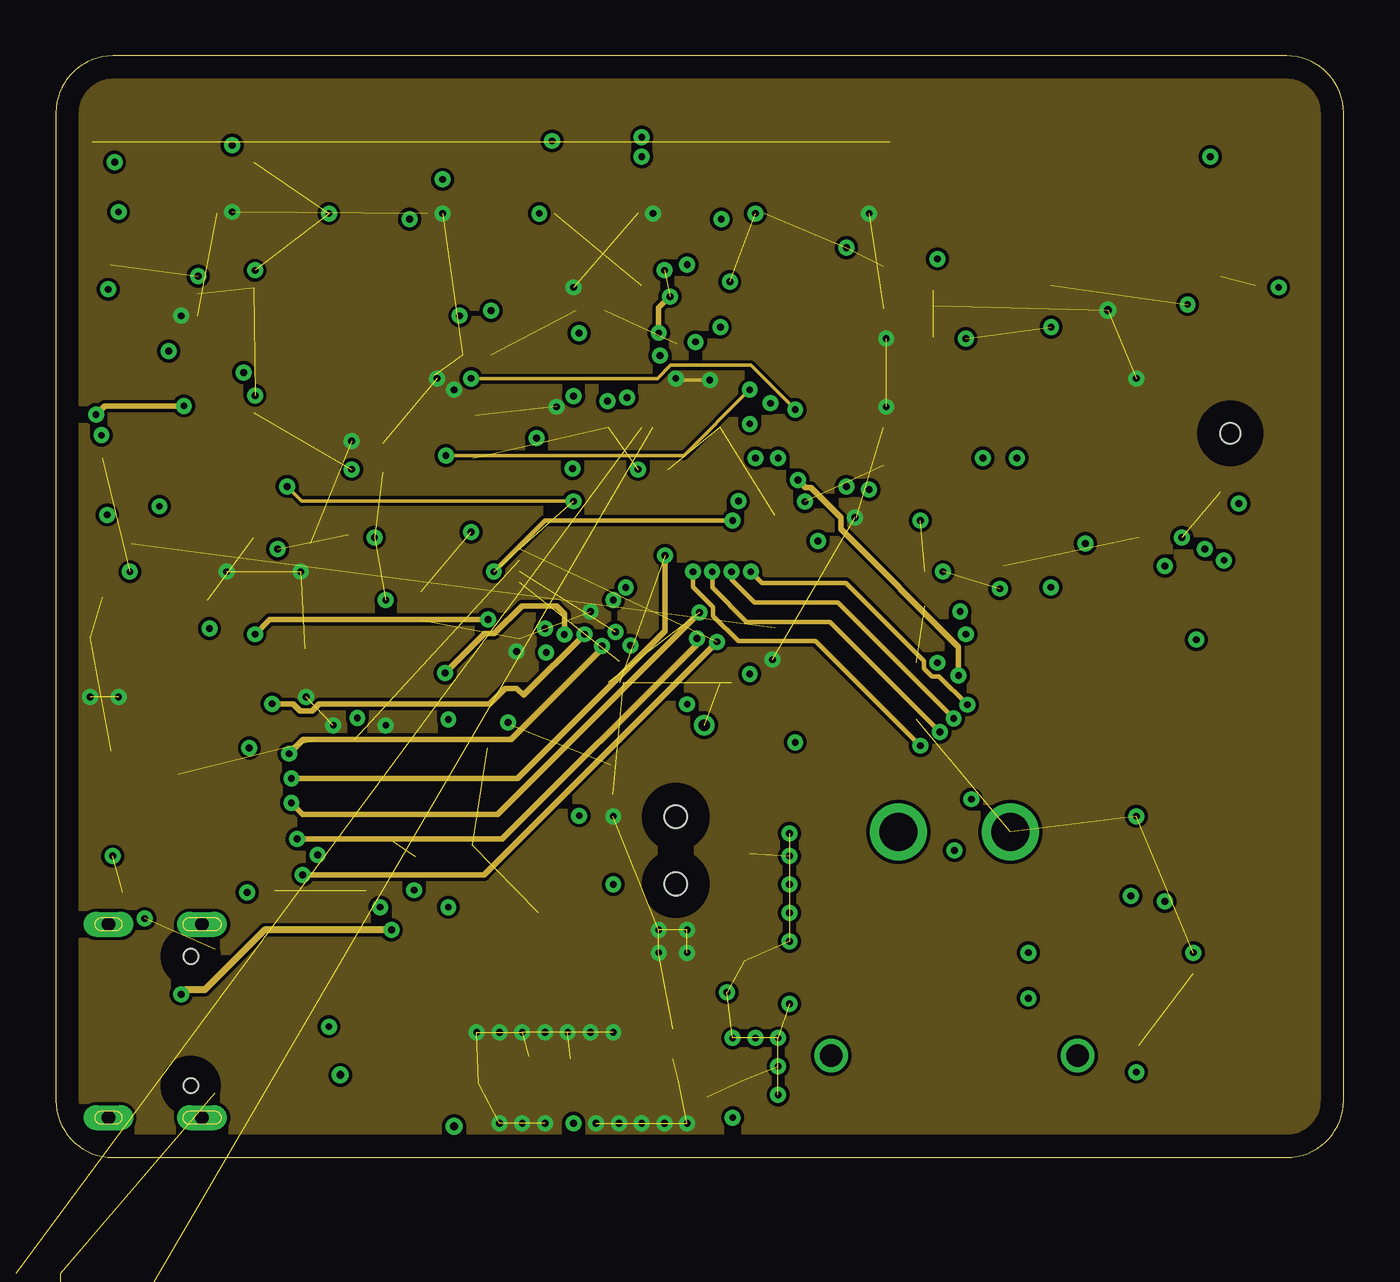
[diagram p4: board, inner layer VCC]
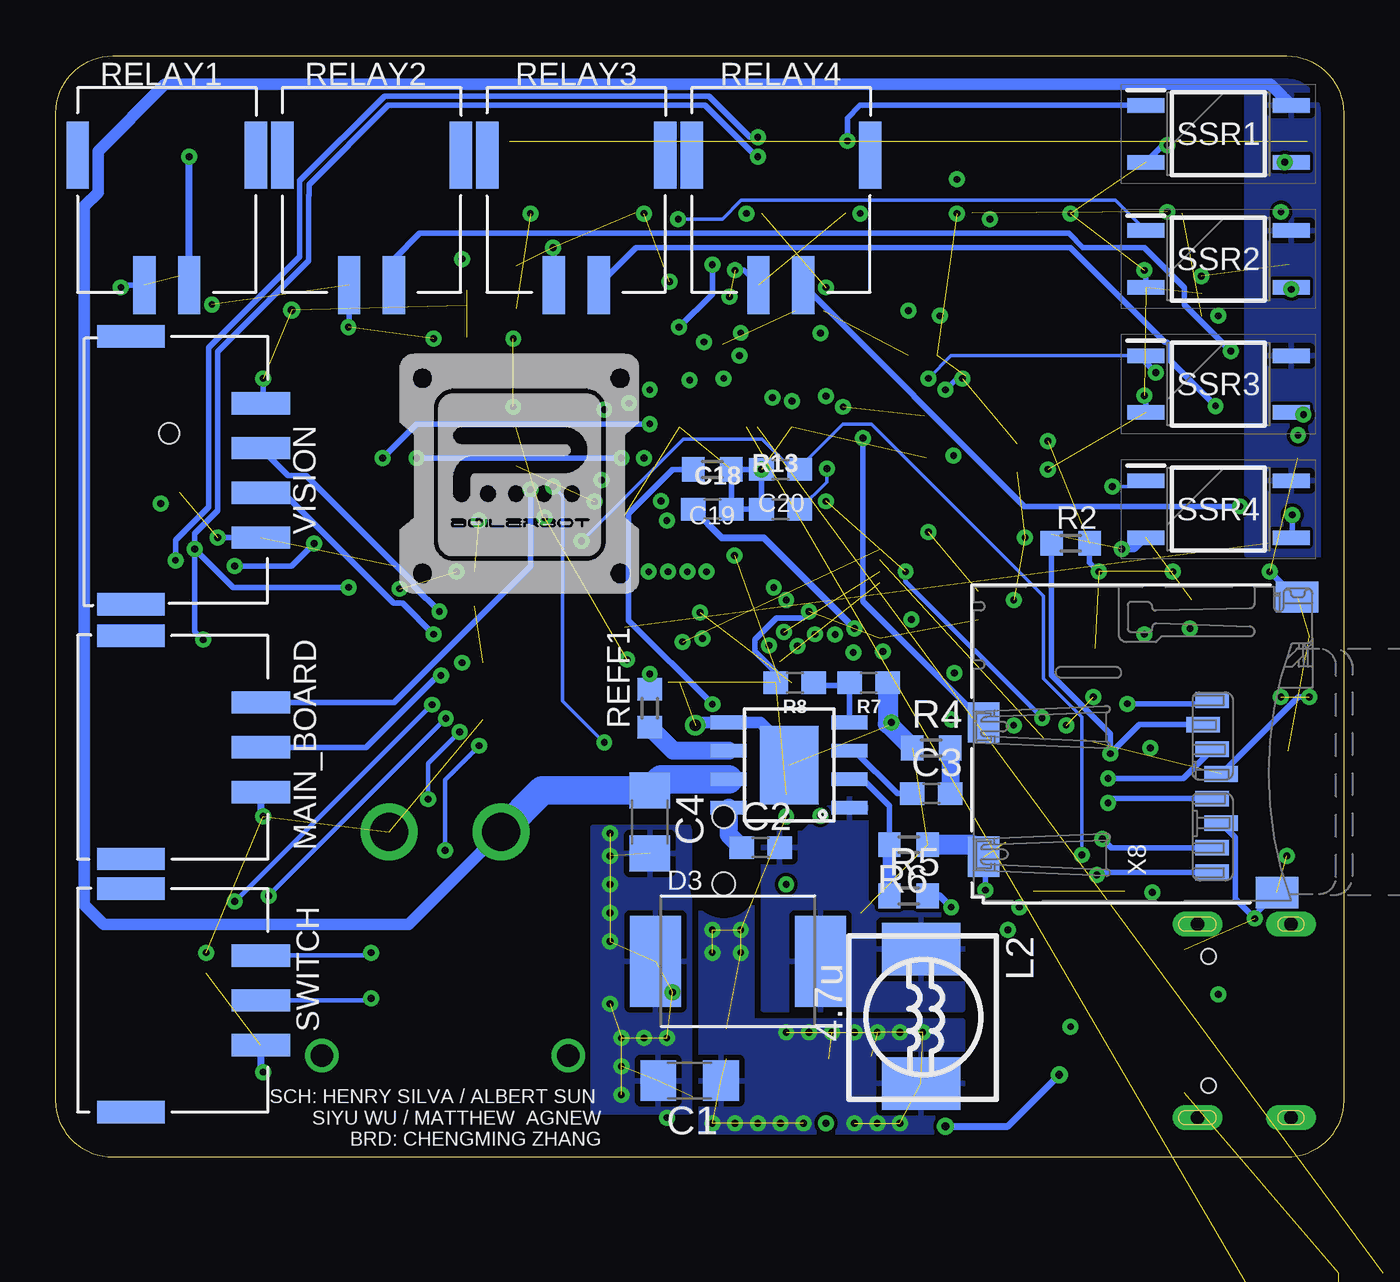
[diagram p5: board, bottom side, seen from below]

Size 57.51 x 49.2 mm. Coordinates in mm from the lower left corner, seen from the top.
Outline: 0,46.66 0,2.54 arc90 2.54,0 54.97,0 arc90 57.51,2.54 57.51,46.66 arc90 54.97,49.2 2.54,49.2 arc90 0,46.66
Copper layers (1+2*15+16): Top 0.035mm / dielectric 1.5mm / GND 0.035mm / dielectric 0.15mm / VCC 0.035mm / dielectric 0.2mm / Bottom 0.035mm
Design rules "default *": minimum track width 6mil, minimum drill 0.3mm, track to track 6mil, track to pad 6mil, pad to pad 6mil, via to via 6mil, smd to smd 6mil, copper to edge 40mil, drill to drill 6mil, minimum pad ring 10mil, minimum via ring 8mil, stop-mask expansion 4mil, vias tented up to drill 15mil, thermal gap 10mil

### Footprints (pad centres in the part's own frame; a part is rotated, then mirrored left to right if it is on the bottom)
XT30PWM = drill 1.7 pad 2.55: 1 -2.5,-5.912; 2 2.5,-5.912 | drill 1 pad 1.5: 3 5.5,4.088; 4 -5.5,4.088
BM03-GHS-TBT = smd 0.6 x 1.7: 1 1.915,5.08; 2 3.165,5.08; 3 4.415,5.08 | smd 1 x 2.8: A 0.065,1.73; B 6.245,1.73
C1206 = smd 1.6 x 1.8: 1 -1.4,0; 2 1.4,0
C0603 = smd 1.1 x 1: 1 -0.85,0; 2 0.85,0
0805-NO = smd 1.24 x 1.5: 1 -0.95,0; 2 0.95,0
0603-NO = smd 1.075 x 1: 1 -0.85,0; 2 0.85,0
SOT96-1 = smd 0.6 x 1.3: 1 -1.905,-2.65; 2 -0.635,-2.65; 3 0.635,-2.65; 4 1.905,-2.65; 5 1.905,2.65; 6 0.635,2.65; 7 -0.635,2.65; 8 -1.905,2.65
JST_S2B-ZR-SM4A-TF(LF)(SN) = smd 0.7 x 2.5: 1 -0.75,2.15; 2 0.75,2.15 | smd 1.1 x 1.9: S1 -2.7,-1.45; S2 2.7,-1.45
CHIPLED_0805_NOOUTLINE = smd 1.2 x 1.2: A 0,-1.05; C 0,1.05
SOT23-3 = smd 0.8 x 0.9: 1 -0.95,-1; 2 0.95,-1; 3 0,1.1
DO-214AB = smd 2.286 x 4.064: 1 -3.683,0; 2 3.683,0
SOD-123 = smd 1.4 x 1.4: A 1.85,0; C -1.85,0
0805-NO@1 = smd 1.24 x 1.5: 1 -0.95,0; 2 0.95,0
S2B-PH-SM4_TB = smd 1 x 2.6: 1 3.81,8.28; 2 5.81,8.28 | smd 1 x 3: GND 0.826,2.48; GND2 8.787,2.48
JST_SM04B-GHS-TB(LF)(SN)- = smd 0.6 x 1.7: 1 -1.875,2.275; 2 -0.625,2.275; 3 0.625,2.275; 4 1.875,2.275 | smd 1 x 2.7: SH1 -3.725,-0.925; SH2 3.725,-0.925
LGA16_3X3MM = smd 0.5 x 0.25: 1 -1.35,1; 2 -1.35,0.5; 3 -1.35,0; 4 -1.35,-0.5; 5 -1.35,-1; 9 1.35,-1; 10 1.35,-0.5; 11 1.35,0; 12 1.35,0.5; 13 1.35,1 | smd 0.25 x 0.5: 6 -0.5,-1.35; 7 0,-1.35; 8 0.5,-1.35; 14 0.5,1.35; 15 0,1.35; 16 -0.5,1.35
MHCI0603-4R7M-R8 = smd 2.35 x 3.5: P$1 0.6,3.23; P$2 6.6,3.23
S3B-PH-SM4_TB = smd 1 x 2.6: 1 3.81,8.28; 2 5.81,8.28; 3 7.81,8.28 | smd 1 x 3: GND 0.826,2.48; GND2 10.794,2.48
LED3535 = smd 1 x 0.85: 1 -1.75,0.875; 2 -1.75,-0.875; 3 1.75,-0.875; 4 1.75,0.875
CHIPLED_0603 = smd 0.8 x 0.8: A 0,-0.75; C 0,0.75
2X05_1.27MM_SMT = smd 0.65 x 2.6: 1 -2.54,-1.85; 2 -2.54,1.85; 3 -1.27,-1.85; 4 -1.27,1.85; 5 0,-1.85; 6 0,1.85; 7 1.27,-1.85; 8 1.27,1.85; 9 2.54,-1.85; 10 2.54,1.85
JST_SH4 = smd 0.6 x 1.55: 1 -1.5,2.514; 2 -0.5,2.514; 3 0.5,2.514; 4 1.5,2.514 | smd 1.2 x 1.8: MT1 -2.8,-1.386; MT2 2.8,-1.386
R0603 = smd 1 x 1.1: 1 -0.85,0; 2 0.85,0
0603 = smd 1.1 x 1: 1 -0.85,0; 2 0.85,0
BTN_KMR2_4.6X2.8 = smd 0.9 x 0.9: A 2.05,0.8; A' -2.05,0.8; B 2.05,-0.8; B' -2.05,-0.8
0805-ARV = smd 0.65 x 1: 1 -1.905,-1; 2 -0.635,-1; 3 0.635,-1; 4 1.905,-1; 5 1.905,1; 6 0.635,1; 7 -0.635,1; 8 -1.905,1
SOIC8_150MIL = smd 0.6 x 2.2: 1 -1.905,-2.6; 2 -0.635,-2.6; 3 0.635,-2.6; 4 1.905,-2.6; 5 1.905,2.6; 6 0.635,2.6; 7 -0.635,2.6; 8 -1.905,2.6
SOP254P700X230-4N = smd 1.65 x 0.65: 1 -3.25,1.27; 2 -3.25,-1.27; 3 3.25,-1.27; 4 3.25,1.27
TQFP64 = smd 1.143 x 0.305: 1 -5.7,3.75; 2 -5.7,3.25; 3 -5.7,2.75; 4 -5.7,2.25; 5 -5.7,1.75; 6 -5.7,1.25; 7 -5.7,0.75; 8 -5.7,0.25; 9 -5.7,-0.25; 10 -5.7,-0.75; 11 -5.7,-1.25; 12 -5.7,-1.75; 13 -5.7,-2.25; 14 -5.7,-2.75; 15 -5.7,-3.25; 16 -5.7,-3.75; 33 5.7,-3.75; 34 5.7,-3.25; 35 5.7,-2.75; 36 5.7,-2.25; 37 5.7,-1.75; 38 5.7,-1.25; 39 5.7,-0.75; 40 5.7,-0.25; 41 5.7,0.25; 42 5.7,0.75; 43 5.7,1.25; 44 5.7,1.75; 45 5.7,2.25; 46 5.7,2.75; 47 5.7,3.25; 48 5.7,3.75 | smd 0.305 x 1.143: 17 -3.75,-5.7; 18 -3.25,-5.7; 19 -2.75,-5.7; 20 -2.25,-5.7; 21 -1.75,-5.7; 22 -1.25,-5.7; 23 -0.75,-5.7; 24 -0.25,-5.7; 25 0.25,-5.7; 26 0.75,-5.7; 27 1.25,-5.7; 28 1.75,-5.7; 29 2.25,-5.7; 30 2.75,-5.7; 31 3.25,-5.7; 32 3.75,-5.7; 49 3.75,5.7; 50 3.25,5.7; 51 2.75,5.7; 52 2.25,5.7; 53 1.75,5.7; 54 1.25,5.7; 55 0.75,5.7; 56 0.25,5.7; 57 -0.25,5.7; 58 -0.75,5.7; 59 -1.25,5.7; 60 -1.75,5.7; 61 -2.25,5.7; 62 -2.75,5.7; 63 -3.25,5.7; 64 -3.75,5.7
EG1390 = smd 1 x 1.5: O1 -2.5,2.8; O2 -2.5,-2.8; P1 0,2.8; P2 0,-2.8; S1 2.5,2.8; S2 2.5,-2.8 | hole 1: 1.5,0; -1.5,0
BLE_MODULE_RAYTAC_MDBT40 = smd 1.85 x 0.45: 1 -4.825,4; 2 -4.825,3.3; 3 -4.825,-0.9; 4 -4.825,-1.6; 5 -4.825,-2.3; 6 -4.825,-3; 7 -4.825,-3.7; 8 -4.825,-4.4; 9 -4.825,-5.1; 10 -4.825,-5.8; 11 -4.825,-6.5; 12 -4.825,-7.2; 26 4.825,-7.2; 27 4.825,-6.5; 28 4.825,-5.8; 29 4.825,-5.1; 30 4.825,-4.4; 31 4.825,-3.7; 32 4.825,-3; 33 4.825,-2.3; 34 4.825,-1.6; 35 4.825,-0.9; 36 4.825,-0.2; 37 4.825,0.5; 38 4.825,1.2; 39 4.825,1.9; 40 4.825,2.6; 41 4.825,3.3; 42 4.825,4 | smd 0.45 x 1.85: 13 -4.2,-8.825; 14 -3.5,-8.825; 15 -2.8,-8.825; 16 -2.1,-8.825; 17 -1.4,-8.825; 18 -0.7,-8.825; 19 0,-8.825; 20 0.7,-8.825; 21 1.4,-8.825; 22 2.1,-8.825; 23 2.8,-8.825; 24 3.5,-8.825; 25 4.2,-8.825 | hole 0.9: 2.2,4.45
SOT23-5 = smd 0.55 x 1.2: 1 -0.95,-1.3; 2 0,-1.3; 3 0.95,-1.3; 4 0.95,1.3; 5 -0.95,1.3
MP1584_V2 = smd 1.6 x 0.61: BST 2.7,1.905; COMP -2.7,-0.635; EN -2.7,0.635; FB -2.7,-1.905; FREQ 2.7,-0.635; GND 2.7,-1.905; SW -2.7,1.905; VIN 2.7,0.635 | smd 2.62 x 3.51: GND_B 0,0
USB_C_CUSB31-CFM2AX-01-X = smd 0.575 x 1.15: A1B12 -3.2,3.545; A4B9 -2.4,3.545; B1A12 3.2,3.545; B4A9 2.4,3.545 | smd 0.275 x 1.15: A5 -1.25,3.545; A6 -0.25,3.545; A7 0.25,3.545; A8 1.25,3.545; B5 1.75,3.545; B6 0.75,3.545; B7 -0.75,3.545; B8 -1.75,3.545 | drill 0.6 pad 1 long: M1 -4.32,2.97; M2 4.32,2.97; M3 -4.32,-1.21; M4 4.32,-1.21 | hole 0.65: 2.89,2.47; -2.89,2.47
S4B-PH-SM4_TB = smd 1 x 2.6: 1 3.27,7.9; 2 5.27,7.9; 3 7.27,7.9; 4 9.27,7.9 | smd 1 x 3: GND 0.286,2.1; GND2 12.254,2.1
XTAL3215 = smd 1.1 x 1.9: P$1 1.2,0; P$2 -1.2,0
MICROSD = smd 0.7 x 1.5: 1 9,-10.64; 2 7.9,-10.24; 3 6.8,-10.64; 4 5.7,-11.04; 5 4.6,-10.64; 6 3.5,-11.04; 7 2.4,-10.64; 8 1.3,-10.64 | smd 1.8 x 1.4: CD1 2,-0.44; CD2 8,-0.44 | smd 1.4 x 1.9: MT1 0.4,-13.54; MT2 13.6,-14.44
CRYSTAL_2.5X2 = smd 0.9 x 0.75: 1 -0.825,-0.625; 2 0.825,-0.625; 3 0.825,0.625; 4 -0.825,0.625

### Placement (x,y rotation side)
24V  40.13,8.64 180 top
AMMO_DETEC  55.88,3.81 90 top
C1  29.21,3.43 180 bottom
C2  26.04,13.84 0 bottom
C3  18.41,16.26 0 bottom
C4  30.99,14.99 270 bottom
C5  36.96,38.86 90 top
C6  36.7,28.57 0 top
C7  16,4.57 270 top
C8  27.56,6.6 90 top
C9  22.99,3.56 270 top
C10  29.08,3.56 270 top
C11  24.51,3.56 270 top
C12  29.08,6.6 90 top
C13  27.56,3.56 270 top
C14  26.04,3.56 270 top
C15  2.92,31.24 180 top
C16  26.04,6.6 90 top
C17  37.97,26.16 0 top
C18  25.15,30.73 180 bottom
C19  25.15,28.96 180 bottom
C20  28.19,28.96 0 bottom
C21  17.78,31.24 0 top
C22  17.78,29.21 0 top
C23  37.59,22.1 0 top
C24  37.97,24.64 0 top
C25  37.59,19.56 0 top
C26  36.96,31.75 270 top
CAN_CONVERTER  11.94,31.24 90 top
CANBUS  53.09,23.88 90 top
CANBUS1  53.09,15.37 90 top
D1  16.13,16.13 90 top
D2  43.43,26.42 90 top
D3  27.05,8.76 0 bottom
D4  16.13,14.1 90 top
D5  19.94,8.13 0 top
FB1  17.78,33.15 180 top
GPIO_AUX1  -5.59,-13.46 0 top  (outside the outline)
GPIO_AUX2  -5.59,-24.38 0 top  (outside the outline)
I2C_1  5.33,44.45 180 top
I2C_2  24.13,44.45 180 top
I2C_4  14.73,44.45 180 top
I2C_5  33.53,44.45 180 top
IMU  29.08,36.83 90 top
L2  22.1,9.91 270 bottom
MAIN_BOARD  56.64,24.13 270 bottom
NEO  12.45,16.89 270 top
PC13  1.52,24 180 top
POW  3.56,24 180 top
PROGRAMMER  4.32,16.89 270 top
Q1  15.11,8.13 270 top
QWIIC  3.81,37.08 270 top
R1  15.88,18.29 180 top
R2  12.19,27.43 0 bottom
R4  18.41,18.29 0 bottom
R5  19.43,11.68 0 bottom
R6  19.43,13.97 180 bottom
R7  21.21,21.21 180 bottom
R8  24.51,21.21 180 bottom
R9  20.95,17.53 180 top
R10  20.95,12.95 180 top
R11  7.62,24.89 180 top
R12  2.54,27.43 180 top
R13  28.19,30.73 0 bottom
R14  20.95,15.11 0 top
R17  10.16,4.32 180 top
R18  10.16,7.37 180 top
R19  20.7,10.92 180 top
R20  14.1,4.57 90 top
R24  12.19,27.81 180 top
R25  6.35,32.51 0 top
R26  6.35,29.97 0 top
R27  6.35,27.43 180 top
REFF1  30.99,20.07 90 bottom
RELAY1  47.75,47.24 180 bottom
RELAY2  38.61,47.24 180 bottom
RELAY3  29.46,47.24 180 bottom
RELAY4  20.32,47.24 180 bottom
RESET  11.81,12.7 0 top
RN1  17.53,36.83 180 top
RN2  23.88,36.83 0 top
SPI_FLASH  13.72,23.37 90 top
SSR1  5.59,45.72 0 bottom
SSR2  5.59,40.13 0 bottom
SSR3  5.59,34.54 0 bottom
SSR4  5.59,28.96 0 bottom
STM32F405RGTX  26.42,26.92 180 top
SW1  27.69,13.72 270 top
SWITCH  56.64,12.83 270 bottom
U1  48.01,34.54 270 top
U2  19.81,3.56 270 top
U$10  24.77,17.53 180 bottom
USB_C  3.56,6.1 270 top
VISION  56.26,36.96 270 bottom
X4  34.8,20.83 270 top
X8  16.51,11.43 90 bottom
Y2  35.18,25.4 270 top

### Tracks (layer width: path | path; a pad name or v marks a point on that pad's centre or on a via)
3.3V  (via drill 0.3, 0.35)  (48 unrouted)
  Top 0.152: FB1.1 17.78,34.1 v17.78,34.29 | STM32F405RGTX.19 29.17,34.68 v29.2,34.72
  Top 0.254: STM32F405RGTX.32 22.67,33.21 v22.35,33.53 | RN2.6 RN2.7 23.24,38.74 v23.12,38.86 | 29.21,32.58 STM32F405RGTX.19 | C26.1 37.98,31.58 37.98,31.4 38.34,31.04 U1.24 | R27.1 7.2,26.58 v7.62,26.16 | PROGRAMMER.1 2.47,20.25 v2.79,20.57 | U1.3 47.11,37.96 v46.99,37.85 | R1.2 14.26,17.53 12.19,17.53 11.57,18.15 NEO.2 12.23,19.3 v12.39,19.3 | STM32F405RGTX.64 30.35,21.41 30.35,21.85 30.73,22.23 v32,22.23 | SW1.O2 v24.89,15.25 v24.89,15.24 | QWIIC.2 v5.6,37.58 v5.59,37.59 | IMU.16 27.73,34.84 v27.69,34.8 28.08,35.2 IMU.1
  Top 0.305: SPI_FLASH.3 12.95,24 12.34,23.4 11.78,23.4 SPI_FLASH.7 SPI_FLASH.8 11.18,21.4 v11.18,20.57 | R1.2 14.73,18.58 v14.73,19.3 | RN1.8 RN1.7 | 16.89,34.92 v17.02,34.8 | CAN_CONVERTER.3 13.34,31.88 v13.21,32 | U1.14 37.09,38.04 C5.1 36.96,36.7 v37.08,36.58 | I2C_5.1 36.31,42.17 v36.32,42.16 | I2C_2.1 26.02,42.16 v26.67,42.16 | I2C_4.1 16.62,42.16 v17.27,42.16 | I2C_1.1 7.81,42.17 v7.87,42.23 | C26.1 36.96,33.4 v37.08,33.53 | C6.1 v35.69,28.57 | STM32F405RGTX.48 20.72,22.75 v20.57,22.61
  Top 0.457: U2.5 24.41,4.51 C11.1 C14.1 | C14.1 C13.1 | C13.1 C10.1 C12.1 | C13.1 C8.1 | C16.1 C14.1
  VCC 0.152: v29.2,34.72 27.76,34.72 v27.69,34.8
  Bottom 0.254: VISION.1 48.26,33.79 v48.26,34.8 | R2.2 11.34,26.58 v10.92,26.16 | X8.4 2.03,20.57 v1.52,20.57 | R8.2 25.36,21.67 26.3,22.61 26.3,23.13 25.32,24.11 24.16,24.11 v23.88,24.38 | v17.78,34.29 17.27,34.8 v17.02,34.8
  other vias: 26.92,10.16 28.19,10.16 28.19,9.14 26.92,9.14 18.8,5.59 19.81,5.59 20.83,5.59 21.84,5.59 22.86,5.59 23.88,5.59 24.89,5.59 28.19,1.52 27.18,1.52 26.16,1.52 25.15,1.52 24.13,1.52 21.84,1.52 20.83,1.52 19.81,1.52
  pour VCC: -1.27,49.53 -1.27,0 58.42,0 58.42,49.53
  pour Bottom: 17.02,6.1 26.42,6.1 26.42,12.95 28.7,12.95 28.7,1.02 17.02,1.02
  pour Top: 29.72,3.56 22.35,3.56 20.07,3.56 20.07,6.1 29.72,6.1
3V3EN
  Bottom 0.254: R6.2 20.28,15.71 21.46,16.89 U$10.EN
  Bottom 0.61: R6.2 R5.1
24V  (via drill 0.3)
  Top 0.305: 24V.2 37.63,13.25 30.99,6.6 19.81,6.6 19.3,7.11 19.3,8.89 17.53,10.67 v17.53,11.18 15.43,9.08 Q1.1
  Bottom 0.305: R5.2 18.03,11.68 v17.53,11.18
  Bottom 0.508: SSR1.4 3.28,47.93 52.65,47.93 55.63,44.95 55.63,43.1 56.24,42.49 56.24,11.28 55.37,10.41 41.77,10.41 24V.2
  Bottom 1.27: 24V.2 35.79,16.39 C4.1 30.48,16.89 U$10.VIN
  pour Bottom: 4.32,49.78 4.32,26.92 -0.51,26.92 -0.51,49.78
!RESET  (via drill 0.3)
  Top 0.152: v11.68,13.51 v11.68,13.5 9.91,13.5 | STM32F405RGTX.7 32.68,26.17 v34.04,27.53
  Top 0.254: PROGRAMMER.10 7.02,13.5 RESET.A' 9.91,13.5 RESET.A
  Bottom 0.152: v11.68,13.51 11.68,19.68 13.4,21.39 13.4,25.08 21.08,32.77 22.35,32.77 24.3,30.82 C18.1 24.62,30.73 25.97,32.08 29.49,32.08 v34.04,27.53
AMMO1  (via drill 0.3)
  Top 0.203: STM32F405RGTX.20 28.67,31.81 28.6,31.75 28.6,29.06 31.04,26.62 v31.04,26.16 | v49.53,11.43 52.32,8.64 52.32,6.6 51.45,5.72 AMMO_DETEC.1
  VCC 0.203: v31.04,26.16 31.54,25.65 35.28,25.65 38.76,22.17 38.76,21.84 39.12,21.49 39.44,21.49 v40.71,20.22
  Bottom 0.203: v40.71,20.22 49.5,11.43 v49.53,11.43
AMMO2  (via drill 0.3)
  Top 0.203: v30.18,26.16 30.18,26.78 28.17,28.79 STM32F405RGTX.21 | AMMO_DETEC.2 49.41,6.97 48.01,8.38 v48.01,11.68
  VCC 0.203: v30.18,26.16 30.18,25.8 31.19,24.79 34.92,24.79 v40.1,19.61
  Bottom 0.203: v40.1,19.61 48.01,11.7 v48.01,11.68
BOARD_RX  (via drill 0.3)
  Top 0.254: STM32F405RGTX.15 32.18,30.24 32.8,30.24 32.82,30.26 v33.15,30.26
  VCC 0.254: v33.15,30.26 33.49,29.92 33.71,29.92 35.05,28.58 35.05,28.06 40.32,22.79 v40.32,21.52
  Bottom 0.254: MAIN_BOARD.2 43.66,18.32 40.39,21.59 v40.32,21.52
BOARD_TX  (via drill 0.3)
  Top 0.152: STM32F405RGTX.14 32,29.79 31.45,29.79 31.24,30 v31.24,31.24
  GND 0.152: v31.24,31.24 31.43,31.24 32.02,31.83 34.33,31.83 v36.32,29.83
  Bottom 0.254: MAIN_BOARD.1 42.42,20.32 36.32,26.42 v36.32,29.83
BOOT0  (via drill 0.3)
  Top 0.254: v28.19,20.24 28.17,20.27 STM32F405RGTX.60
  Bottom 0.254: v28.19,20.24 31.94,23.99 31.94,28.77 29.98,30.73 R13.1
BST1
  Bottom 0.813: U$10.BST 27.46,14.42 C2.1
CAN_N  (via drill 0.3)
  Top 0.254: CAN_CONVERTER.6 10.45,31.88 14.22,35.66 14.22,38.67 16.59,41.05 17.02,41.05 18.69,41.05 20.24,42.6 20.24,42.72 21.97,44.45 22.1,44.45 23.22,45.57 v26.16,45.57 | CANBUS1.2 52.83,18.01 52.83,23.88 52.08,24.63 CANBUS.2 52.17,25.86 v52.17,26.67 51.92,26.42 v49.53,26.42 | D2.2 45.93,27.37 v45.98,27.42
  Top 0.305: CAN_CONVERTER.6 8.65,32.51 R25.2
  Bottom 0.254: v26.16,45.57 26.52,45.57 28.35,47.4 42.84,47.4 46.62,43.62 46.62,43.15 46.63,43.13 46.63,40.23 50.7,36.17 50.7,29.06 52.17,27.58 v52.17,26.67 | v45.98,27.42 46.99,26.42 v49.53,26.42
CAN_P  (via drill 0.3)
  Top 0.254: CAN_CONVERTER.7 10.45,30.61 14.63,34.79 14.63,38.51 16.76,40.64 17.19,40.64 18.86,40.64 20.65,42.43 20.65,42.55 22.14,44.04 22.27,44.04 22.93,44.7 v26.16,44.7 | CANBUS.1 49.8,23.13 49.28,22.61 49.28,15.75 50.41,14.62 CANBUS1.1
  Top 0.305: CAN_CONVERTER.7 8.65,29.97 R26.2
  Bottom 0.254: v26.16,44.7 26.23,44.7 28.52,46.99 42.67,46.99 46.21,43.45 46.21,42.98 46.23,42.96 46.23,40.06 50.29,36 50.29,28.89 51.31,27.87 v51.31,27.18 | v51.31,27.18 51.31,23.5 CANBUS.1 | v51.31,27.18 49.6,25.47 D2.1
  other vias: 50.94,23.13 44.43,25.47
CANRX_N
  Top 0.203: STM32F405RGTX.44 19.28,25.17 15.75,28.7 15.75,32.26 14.86,33.15 CAN_CONVERTER.4
CANTX_P
  Top 0.203: CAN_CONVERTER.1 19.29,24.64 20.68,24.64 STM32F405RGTX.45
CC1
  Top 0.254: USB_C.A5 7.18,7.26 9.21,7.26 R18.2
CC2
  Top 0.254: USB_C.B5 9.28,4.35 R17.2
COMP_3V3
  Bottom 0.254: U$10.COMP 21.84,18.16 19.93,16.26 C3.1
CONNECTED_LED
  Top 0.203: U1.39 49.91,28.16 47.5,25.75 47.5,19.78 44.8,17.08 22.92,17.08 21.76,15.92 21.2,15.92 21.05,15.77 21.05,14.46 21.83,13.68 21.83,12.96
  Top 0.305: 21.91,12.96 21.83,12.96 R10.1
D11  (via drill 0.3)
  Top 0.254: v30.48,29.31 31.27,28.53 31.27,28.41 31.5,28.17 STM32F405RGTX.11
  GND 0.254: v30.48,29.31 30.48,32.38 30.35,32.5 30.35,36.41 v29.68,37.08 | v28.19,39.88 26.67,41.4 25.91,41.4 22.15,45.16 v22.15,45.4
  Bottom 0.254: v29.68,37.08 28.19,38.56 v28.19,39.88 | SSR1.1 21.59,46.99 22.15,46.43 v22.15,45.4
D12  (via drill 0.3)
  Top 0.152: STM32F405RGTX.10 32.23,27.79 32.78,27.79 34.24,29.25 34.24,31.75 33.17,32.82 32.78,32.82 v31.91,33.69
  GND 0.152: v29.72,41.91 31.91,39.72 v31.91,33.69
  Bottom 0.152: v29.72,41.91 27.75,41.91 26.91,42.75 10.18,42.75 SSR2.1
D13  (via drill 0.3)
  Top 0.152: v33.02,33.4 34.54,31.88 34.54,28.96 32.76,27.17 STM32F405RGTX.9
  Top 0.254: v8.38,35.05 7.87,35.05 6.35,33.53 6.35,29.21 5.59,28.45 4.41,28.45
  VCC 0.152: v18.54,34.8 26.86,34.8 27.44,35.38 31.04,35.38 v33.02,33.4
  Bottom 0.152: SSR3.1 17.53,35.81 v18.54,34.8
  Bottom 0.254: SSR3.1 8.84,35.51 v8.38,35.05
D14  (via drill 0.3)  (1 unrouted)
  Top 0.152: v23.11,29.31 23.35,29.31 25.36,31.32 26.16,31.32 26.67,31.83 26.67,32.62
  Top 0.203: 13.46,18.78 v13.46,19.63 | STM32F405RGTX.8 32.02,26.77 31.44,26.77 30.23,27.98 v30.23,28.45
  VCC 0.152: v23.11,29.31 10.98,29.31 v10.32,29.97
  VCC 0.203: v19.56,26.16 21.84,28.45 v30.23,28.45
  Bottom 0.152: v10.32,29.97 9.09,29.97 SSR4.1
  Bottom 0.203: v13.46,19.63 19.56,25.73 v19.56,26.16
D+
  Top 0.305: USB_C.B6 7.04,5.4 6.4,5.4 6.22,5.58 6.22,6.11 6.4,6.29 7.04,6.29 USB_C.A6
D-
  Top 0.305: USB_C.B7 7.63,6.85 8.13,6.35 7.62,5.85 USB_C.A7
EN  (via drill 0.35)
  Top 0.305: U2.3 18.51,2.13 v17.78,1.4 | v12.7,3.68 14.06,3.68 R20.1
  Bottom 0.305: v17.78,1.4 14.99,1.4 v12.7,3.68
FB_3V3
  Bottom 0.254: R7.2 22.06,21.08 | 22.06,21.08 U$10.FB | R8.1 23.53,21.08 22.06,21.08
FLASH_CS  (via drill 0.3)
  Top 0.254: STM32F405RGTX.50 23.17,22.9 v22.71,23.36 | SPI_FLASH.1 16.49,21.64 v17.38,21.64 | R1.1 17.53,19.09 v17.53,19.56
  GND 0.254: v17.53,19.56 17.38,19.7 v17.38,21.64
  VCC 0.254: v22.71,23.36 22.71,24.28 22.35,24.64 20.81,24.64 19.57,23.39 19.14,23.39 v17.38,21.64
FLASH_MISO
  Top 0.152: STM32F405RGTX.56 26.17,20.58 25.71,20.12 21.99,20.12 20.55,21.55 18.3,21.55 17.12,22.73 SPI_FLASH.2
FLASH_MOSI
  Top 0.152: STM32F405RGTX.57 26.67,20.58 25.9,19.81 21.76,19.81 20.67,20.9 12.58,20.9 11.67,19.99 10.87,19.99 9.79,21.07 9.79,24.74 10.32,25.27 SPI_FLASH.5
  Top 0.305: R11.1 8.85,25.27 SPI_FLASH.5
FLASH_SCK
  Top 0.152: STM32F405RGTX.55 25.67,20.58 25.51,20.42 22.21,20.42 20.61,22.02 20.33,22.02 18.01,24.34 18.01,25.3 17.51,25.8 14.17,25.8 12.37,24 SPI_FLASH.6
FREQ1
  Bottom 0.813: U$10.FREQ 29.93,18.16 REFF1.1
GND  (via drill 0.3, 0.51)  (62 unrouted)
  Top 0.254: C25.2 C23.2 v39.37,22.1 | C24.2 C17.2 v39.62,26.16 | C6.2 37.65,30.2 C26.2 | U1.25 37.65,28.82 C6.2 | U1.28 42.21,26.54 D2.3 42.33,25.57 v42.16,25.4 | C6.2 38.48,28.57 v38.61,28.45 | U1.42 52.32,29.72 v52.83,29.21 | D1.C D4.C 15.08,13.12 RESET.B 14.48,11.28 v14.48,11.18 | D1.C | v8.54,11.84 9.7,11.84 RESET.B' 9.76,10.78 8.28,9.3 USB_C.A1B12 | 23.11,2.58 C9.2 22.28,2.71 21.83,3.16 18.91,3.16 U2.2 16.17,3.56 C7.2 15.18,2.9 USB_C.B1A12 | 23.11,2.58 v23.11,1.52 | v12.19,5.84 12.19,6.18 R18.1 R17.1 9.59,2.9 7.49,2.9 | USB_C.B1A12 7.26,2.9 | U1.1 U1.2 51.31,38.86 v50.55,38.1 | 23.11,2.58 23.24,2.71 C11.2 C14.2 C13.2 C10.2 29.3,2.71 v30.23,1.78 | STM32F405RGTX.63 29.67,20.61 29.9,20.37 29.92,20.37 29.97,20.32 30.73,20.32 30.99,20.57 v30.99,21.59 | NEO.4 14.31,16.13 D1.C | C15.2 2.03,31.28 v2.03,32.26 2.42,32.65 QWIIC.MT2 | QWIIC.MT1 2.85,40.31 2.85,42.17 | STM32F405RGTX.28 24.67,33.75 v24.64,33.78 | U1.16 40.57,36.64 v40.64,36.58 | STM32F405RGTX.12 32.99,28.67 33.45,29.13 v33.45,29.29 | 7.49,2.9 7.49,2.79 | USB_C.B1A12 7.49,2.9 | STM32F405RGTX.18 29.67,34.24 31.24,35.81 31.24,36.79 30.8,37.23 30.53,37.23 IMU.8 | IMU.15 v26.92,36.83 | IMU.13 27.71,38.18 v27.43,38.46
  Top 0.305: PROGRAMMER.3 PROGRAMMER.5 PROGRAMMER.7 PROGRAMMER.9 2.54,14.28 v2.54,13.46 | C21.2 C22.2 18.63,28.03 v18.54,27.94 | SPI_FLASH.4 15.11,25.27 v14.73,24.89 | R24.1 14.1,27.81 v14.22,27.69 | CAN_CONVERTER.2 13.34,30.61 v13.21,30.73 | C5.2 38.11,39.81 U1.13 | QWIIC.1 6.32,39.34 v6.35,39.37 | I2C_1.4 2.85,42.17 v2.79,42.23 | I2C_4.4 12.85,42.16 v12.19,42.16 | I2C_2.4 22.24,42.16 v21.59,42.16 | I2C_5.4 31.64,42.16 v31.24,42.16 | PC13.C POW.C 5.13,23.25 R11.2 6.77,23.71 v6.86,23.62 | SW1.S2 24.68,11.02 | SW1.S2 24.89,8.6 C16.2 C8.2 C12.2 29.88,7.45 v29.97,7.37 | SW1.S2 v24.89,12.19 | AMMO_DETEC.3 v50.8,9.14 | IMU.13 IMU.12 IMU.11 IMU.10 IMU.9 | IMU.9 30.43,37.83 IMU.8 | IMU.9 30.08,39.12 v30.1,39.12 | 29.39,38.18 IMU.9 | SW1.S2 24.59,10.92 R19.1
  Top 0.508: C5.2 39.05,39.81 v39.37,40.13
  GND 0.254: v30.99,21.59 30.99,20.83
  VCC 0.254: v26.92,36.83 26.92,37.95 v27.43,38.46
  Bottom 0.254: RELAY1.2 54.51,38.96 v54.61,38.86 | X8.CD1 16,13.36 v16,11.94 | X8.MT1 3.96,10.84 v3.96,10.67 4.84,11.55 4.84,14.3 X8.6 | RELAY2.2 44.42,37.12 v44.45,37.08 | RELAY3.2 35.27,40.61 v35.31,40.64 | RELAY4.2 26.79,39.62 v27.18,39.62 | SSR2.2 8.84,39.57 v8.89,39.62 | SSR3.2 8.84,33.98 v8.89,34.04 | VISION.4 v50.29,27.69 | REFF1.2 v30.99,21.59 | X8.MT2 2.17,25.03 v3.3,26.16 | SSR1.2 8.08,45.21 v7.87,45.21 | 20.32,19.3 19.3,18.29 R4.1 20.19,19.22 v20.19,19.43 | C19.2 C18.2 R13.2 C20.2 C19.2
  Bottom 0.305: SSR4.2 9.35,27.18 v9.91,27.18 | SWITCH.3 48.36,3.91 v48.26,3.81 | MAIN_BOARD.3 48.36,15.34 v48.26,15.24
  Bottom 0.508: U$10.GND_B 24.77,18.16 26.04,19.43 U$10.GND 28.83,19.43 v28.96,19.3
  Bottom 0.889: X8.CD1 16.61,13.97 R6.1 | R7.1 20.36,19.38 R4.1
  other vias: 32.26,2.79 32.26,4.06 32.26,5.33 31.24,5.33 30.23,5.33 32.77,6.86 32.77,9.65 32.77,10.92 32.77,12.19 32.77,13.46 32.77,14.48 26,30.73
  pour GND: -1.27,49.53 -1.27,-1.27 58.42,-1.27 58.42,49.53
  pour Bottom: 29.21,14.73 33.53,14.73 33.53,2.03 29.21,2.03
GPIO_AUX1  (1 unrouted)
GPIO_AUX2  (1 unrouted)
I2C-1_CL  (via drill 0.3)
  Top 0.152: I2C_4.2 15.62,41.91 v15.8,41.91 | IMU.2 28.58,34.87 27.93,34.21 27.44,34.21 27.1,34.56 27.1,35.69 v26.98,35.81
  Top 0.203: QWIIC.4 7.14,35.58 7.62,36.07 7.62,39.96 6.54,41.05
  Top 0.254: I2C_4.2 15.36,41.62 14.78,41.05 6.54,41.05 5.96,41.62 I2C_1.2 | v24.89,24.89 27.17,22.62 STM32F405RGTX.58 | 27.05,35.74 v26.98,35.81 | RN2.2 23.24,36.7 v23.37,36.82
  GND 0.152: v15.8,41.91 16.7,41.91 17.03,41.58 18.61,41.58 v23.37,36.82
  GND 0.254: v24.89,24.89 | v24.89,24.89 24.66,25.12 24.66,27.56 26.98,29.87 v26.98,35.81 24.38,35.81 v23.37,36.82
I2C-1_DA  (via drill 0.3)
  Top 0.152: I2C_4.3 14.11,42.55 15.24,43.69 v17.27,43.69 | v28.57,36.43 28.57,37.19 28.08,37.68 26.81,37.68 26.19,37.07 25.87,37.07 24.63,35.83 RN2.3
  Top 0.203: QWIIC.3 5.33,36.58 4.71,37.2 I2C_1.3
  Top 0.254: I2C_4.3 14.11,42.73 13.53,43.3 5.29,43.3 4.71,42.73 I2C_1.3 | v25.45,25.45 27.67,23.24 STM32F405RGTX.59 | v28.57,36.43 29.08,35.91 IMU.3
  GND 0.152: v28.57,36.43 21.31,43.69 v17.27,43.69
  GND 0.254: v25.45,25.45 25.45,27.23 28.57,30.35 v28.57,36.43
I2C-2_CL  (via drill 0.3)
  Top 0.152: v25.5,33.94 25.3,33.94 24.88,34.37 24.4,34.37 24.05,34.02 24.05,33.54 24.17,33.43 STM32F405RGTX.29
  Top 0.203: I2C_2.2 24.06,41.48 24.06,41.22 20.67,37.83 RN1.1
  Top 0.254: I2C_5.2 34.15,41.62 33.57,41.05 25.33,41.05 24.75,41.62 I2C_2.2
  GND 0.152: RN1.1 19.99,37.27 19.99,36.59 20.97,35.61 23.64,35.61 25.3,33.94 v25.5,33.94
  other vias: 19.43,37.83
I2C-2_DA  (via drill 0.3)
  Top 0.152: STM32F405RGTX.30 23.62,32.67 23.62,33.53 23.14,34.01 v23.11,34.01 | RN1.2 18.16,37.72 v18.03,37.59
  Top 0.203: I2C_2.3 22.81,41.48 22.81,41.22 20.17,38.58 19,38.58 18.25,37.83 RN1.2
  Top 0.254: I2C_5.3 32.9,42.73 32.32,43.3 24.08,43.3 23.5,42.73 I2C_2.3
  GND 0.152: v23.11,34.01 21.82,35.31 20.32,35.31 v18.03,37.59
MODE_3V  (via drill 0.3)
  Top 0.152: U1.18 38.94,35 37.73,35 35.31,32.58 v35.31,29.97 | R14.1 20.72,14.5 20.72,14.32 21.08,13.96 21.08,12.31 21.21,12.18 22.4,12.18 23.21,12.99 25.73,12.99 25.86,13.12 25.86,14.31 25.73,14.45 24.19,14.45 v23.37,15.26
  Top 0.457: R14.1 19.94,15.18
  GND 0.152: v33.02,18.54 31.75,17.27 24.64,17.27 23.37,16.01 v23.37,15.26
  Bottom 0.152: v35.31,29.97 34.87,29.54 34.87,20.4 v33.02,18.54
MODE_LED
  Top 0.203: U1.38 49.21,28.38 46.8,25.97 46.8,20.07 44.51,17.78 22.06,17.78 R9.1
N$3
  Bottom 0.813: R4.2 C3.2
N$4
  Top 0.457: SW1.P2 23.2,13.72 R14.2
N$5
  Top 0.305: R9.2 18.58,17.53 D1.A
N$6
  Top 0.305: R10.2 18.32,12.95 D4.A
N$9
  Top 0.203: X4.P$1 34.36,19.63 | X4.P$1 36.67,19.63 C25.1 | X4.P$1 33.53,20.9 33.53,23.34 32.7,24.17 STM32F405RGTX.3
N$10
  Top 0.203: 32.15,24.64 STM32F405RGTX.4 32.77,24.67 33.93,23.52 34.54,23.52 34.8,23.26 X4.P$2 34.87,22.1 C23.1
N$11
  Top 0.203: STM32F405RGTX.5 32.77,25.17 34.07,23.87 35.81,23.87 | C24.1 37.12,24.17 36.83,23.87 35.81,23.87 | Y2.3 35.8,23.88 35.81,23.87
N$12
  Top 0.203: STM32F405RGTX.6 32.21,25.77 32.79,25.77 33.95,26.92 34.54,26.92 | C17.1 37.12,26.63 36.83,26.92 36.29,26.92 36.28,26.93 35.32,26.93 35.32,26.92 34.54,26.92 | Y2.1 34.54,26.23 34.54,26.92
N$13
  Top 0.305: R12.2 1.69,24.92 PC13.A
N$20  (via drill 0.3)
  Top 0.152: STM32F405RGTX.13 32,29.29 31.45,29.29 30.66,30.09 30.66,31.61 31.57,32.52 31.57,33.01 30.99,33.59 v30.99,34.29 | C21.1 17.04,31.35 v17.42,31.35
  Top 0.254: C22.1 C21.1 16.83,31.34 FB1.2
  VCC 0.152: v30.99,34.29 28.05,31.35 v17.42,31.35
N$21
  Top 0.203: R24.2 9.82,29.34 CAN_CONVERTER.8
N$22
  Top 0.305: R26.1 4.32,29.97 3.77,30.52 C15.1 3.77,31.96 4.32,32.51 R25.1
N$23
  Top 0.305: POW.A 5.5,26.7 R27.2
N$32
  Top 0.457: Q1.3 D5.C
NEOPIX  (1 unrouted)
PC13  (1 unrouted)
RELAY1  (via drill 0.3)
  Top 0.305: v2.62,44.45 5.41,47.24 50.04,47.24 51.56,45.72 v51.56,44.7
  Bottom 0.305: SSR1.3 v2.62,44.45 | RELAY1.1 v51.56,44.7
RELAY2  (via drill 0.3)
  Top 0.254: v2.34,38.78 5.03,36.08 v5.03,36.02
  Bottom 0.254: SSR2.3 v2.34,38.78 | v5.03,36.02 7.11,38.1 7.11,38.86 8.89,40.64 11.63,40.64 12.27,41.27 41.27,41.27 42.42,40.13 RELAY2.1
RELAY3  (via drill 0.3)
  VCC 0.254: v1.79,33.18 2.18,33.57 v5.71,33.57
  Bottom 0.254: SSR3.3 2.24,33.18 v1.79,33.18 | v5.71,33.57 7.73,35.59 7.73,36.26 7.9,36.42 7.99,36.42 12.21,40.64 31.6,40.64 RELAY3.1
RELAY4  (via drill 0.3)
  Top 0.254: v2.29,28.7 2.67,29.08 v4.62,29.08
  Bottom 0.254: SSR4.3 2.29,27.74 v2.29,28.7 | v4.62,29.08 14.25,29.08 RELAY4.1
RX_BT  (via drill 0.3)
  Top 0.254: STM32F405RGTX.17 30.85,32.62 v30.99,32.77 | v42.93,31.24 42.93,29.74 U1.29
  Bottom 0.254: v30.99,32.77 41.4,32.77 v42.93,31.24
SD_DETECT  (via drill 0.3)
  Top 0.254: STM32F405RGTX.33 20.72,31.38 v21.46,32.13
  Bottom 0.254: v21.46,32.13 21.46,24.82 X8.CD2
SDIO_CLK  (via drill 0.3)  (1 unrouted)
  Top 0.254: v28.74,24.34 24.9,28.17
  VCC 0.254: v10.52,15.83 11.02,15.33 19.73,15.33 v28.74,24.34
  Bottom 0.254: v10.52,15.83 10.32,16.03 X8.5
SDIO_CMD  (via drill 0.3)  (1 unrouted)
  Top 0.254: v27.2,26.89 25.42,28.67
  VCC 0.254: v27.2,26.89 27.2,23.51 20.63,16.93 v10.52,16.93
  Bottom 0.254: v10.52,16.93 7.17,16.93 X8.3
SDIO_D0  (via drill 0.3)
  Top 0.254: v28.63,23.17 24.13,27.67 STM32F405RGTX.39
  VCC 0.254: v28.63,23.17 28.63,22.92 19.93,14.23 v10.77,14.23
  Bottom 0.254: v10.77,14.23 10.37,13.83 X8.7
SDIO_D1  (via drill 0.3)  (1 unrouted)
  Top 0.254: v29.53,23.03 30.17,23.67
  VCC 0.254: v11.02,12.62 19.12,12.62 v29.53,23.03
  Bottom 0.254: v11.02,12.62 10.91,12.73 X8.8
SDIO_D2  (via drill 0.3)
  Top 0.254: STM32F405RGTX.51 23.67,23.32 v23.61,23.37
  VCC 0.254: v9.65,20.26 10.59,20.26 10.91,19.94 11.44,19.94 11.76,20.26 19.37,20.26 20.06,20.95 20.58,20.95 20.89,20.65 v23.61,23.37
  Bottom 0.254: 9.49,20.43 v9.65,20.26 6.04,20.26 X8.1
SDIO_D3  (via drill 0.3)
  Top 0.254: STM32F405RGTX.52 24.17,22.62 v24.39,22.84
  VCC 0.254: v10.42,18.03 11.05,18.67 19.56,18.67 | 19.56,18.67 20.33,18.67 24.39,22.73 v24.39,22.84 | 19.56,18.67
  Bottom 0.254: X8.2 9.12,19.33 v10.42,18.03 10.42,18.92 13.04,21.54 R2.1
SHIELD  (7 unrouted)
SW1
  pour Bottom: 17.02,10.92 20.83,10.92 21.34,11.43 21.34,11.68 21.34,16 22.86,16 22.86,15.75 24.13,14.48 25.91,14.48 25.91,6.6 17.02,6.6
SWCLK  (via drill 0.3)
  Top 0.254: STM32F405RGTX.49 22.67,21.78 v21.9,22.55 | PROGRAMMER.4 8.51,18.16 v8.64,18.29
  GND 0.254: v21.9,22.55 20.3,20.95 20.06,20.95 17.77,18.67 10.15,18.67 9.77,18.29 v8.64,18.29
SWDIO  (via drill 0.3)
  Top 0.254: PROGRAMMER.2 6.17,20.65 v8.89,23.37 | STM32F405RGTX.46 20.65,24.11 20.03,24.11 19.95,24.03 v19.3,24.03
  VCC 0.254: v8.89,23.37 9.55,24.03 v19.3,24.03
SWITCH1  (via drill 0.3)
  Top 0.203: v29.31,26.16 29.31,26.93 27.67,28.58 STM32F405RGTX.22 | v43.43,9.14 40.89,11.68 v40.89,16
  VCC 0.203: v29.31,26.16 29.31,25.45 30.84,23.93 34.56,23.93 v39.49,19
  Bottom 0.203: SWITCH.1 43.56,9.02 v43.43,9.14 | v39.49,19 40.89,17.59 v40.89,16
SWITCH2  (via drill 0.3)
  Top 0.203: v28.45,26.16 28.45,27.09 27.17,28.37 STM32F405RGTX.23 | v40.13,13.72 40.13,10.41 v43.43,7.11
  VCC 0.203: v38.61,18.39 33.93,23.06 30.48,23.06 29.35,24.19 29.35,24.59 28.45,25.49 v28.45,26.16
  Bottom 0.203: v38.61,18.39 40.13,16.87 v40.13,13.72 | SWITCH.2 43.53,7.02 v43.43,7.11
TX_BT  (via drill 0.3)
  Top 0.254: U1.27 41.51,31.14 v41.4,31.24 | v32.26,31.24 32.12,31.1 STM32F405RGTX.16
  Bottom 0.254: v41.4,31.24 v32.26,31.24
VBUS  (via drill 0.3)
  Top 0.305: D5.A 19.85,10.07 R19.2 19.05,10.92 18.03,11.94 16.94,11.94 16.28,11.28 16.1,11.28 v14.99,10.16 | USB_C.A4B9 6.99,8.38 6.35,8.38 5.59,7.62 v5.59,7.29 5.59,4.32 6.1,3.81 6.99,3.81 USB_C.B4A9
  VCC 0.305: v5.59,7.29 5.79,7.49 6.64,7.49 9.31,10.16 v14.99,10.16
VCAP1  (via drill 0.3)
  Top 0.152: STM32F405RGTX.31 23.17,30.86 v23.07,30.77
  Bottom 0.152: C19.1 23.07,30.18 v23.07,30.77
VCAP2  (via drill 0.3)
  Top 0.305: STM32F405RGTX.47 21.79,23.67 v21.84,23.62
  Bottom 0.305: C20.1 27.77,27.69 25.91,27.69 v21.84,23.62
VHI
  Top 0.457: U2.1 17.62,5.39 16.03,5.39 C7.1 R20.2 | 14.12,5.39 R20.2 | R20.2 14.1,7.16 Q1.2
VISION_RX  (via drill 0.3)  (1 unrouted)
  Top 0.254: 25.17,22.15 25.43,22.41 25.43,22.64 v25.66,22.87
  GND 0.254: v40.64,23.37 40.14,22.87 30.52,22.87 30.05,22.4 28.51,22.4 28.04,22.87 v25.66,22.87
  Bottom 0.254: v40.64,23.37 42.04,24.77 42.43,24.77 47.35,29.69 VISION.3
VISION_TX  (via drill 0.3)  (1 unrouted)
  Top 0.254: 24.67,22.22 25.03,22.58 25.03,23.11 24.99,23.15 v24.99,23.47
  GND 0.254: v40.39,24.38 29.59,24.38 29,24.97 26.49,24.97 v24.99,23.47
  Bottom 0.254: VISION.2 47.14,30.47 46.33,30.47 41.53,25.66 41.53,25.53 v40.39,24.38

### Text on the board
Top: FIX SWITCH, LED PIN
tPlace: X | Z | Y
tNames: PURDUE ROBOMASTER / ELECTRICAL CONTROLER V4.0
bNames: SCH: HENRY SILVA / ALBERT SUN / SIYU WU / MATTHEW AGNEW / BRD: CHENGMING ZHANG